# Altium project ECU.PrjPcb (part 1 of 2)
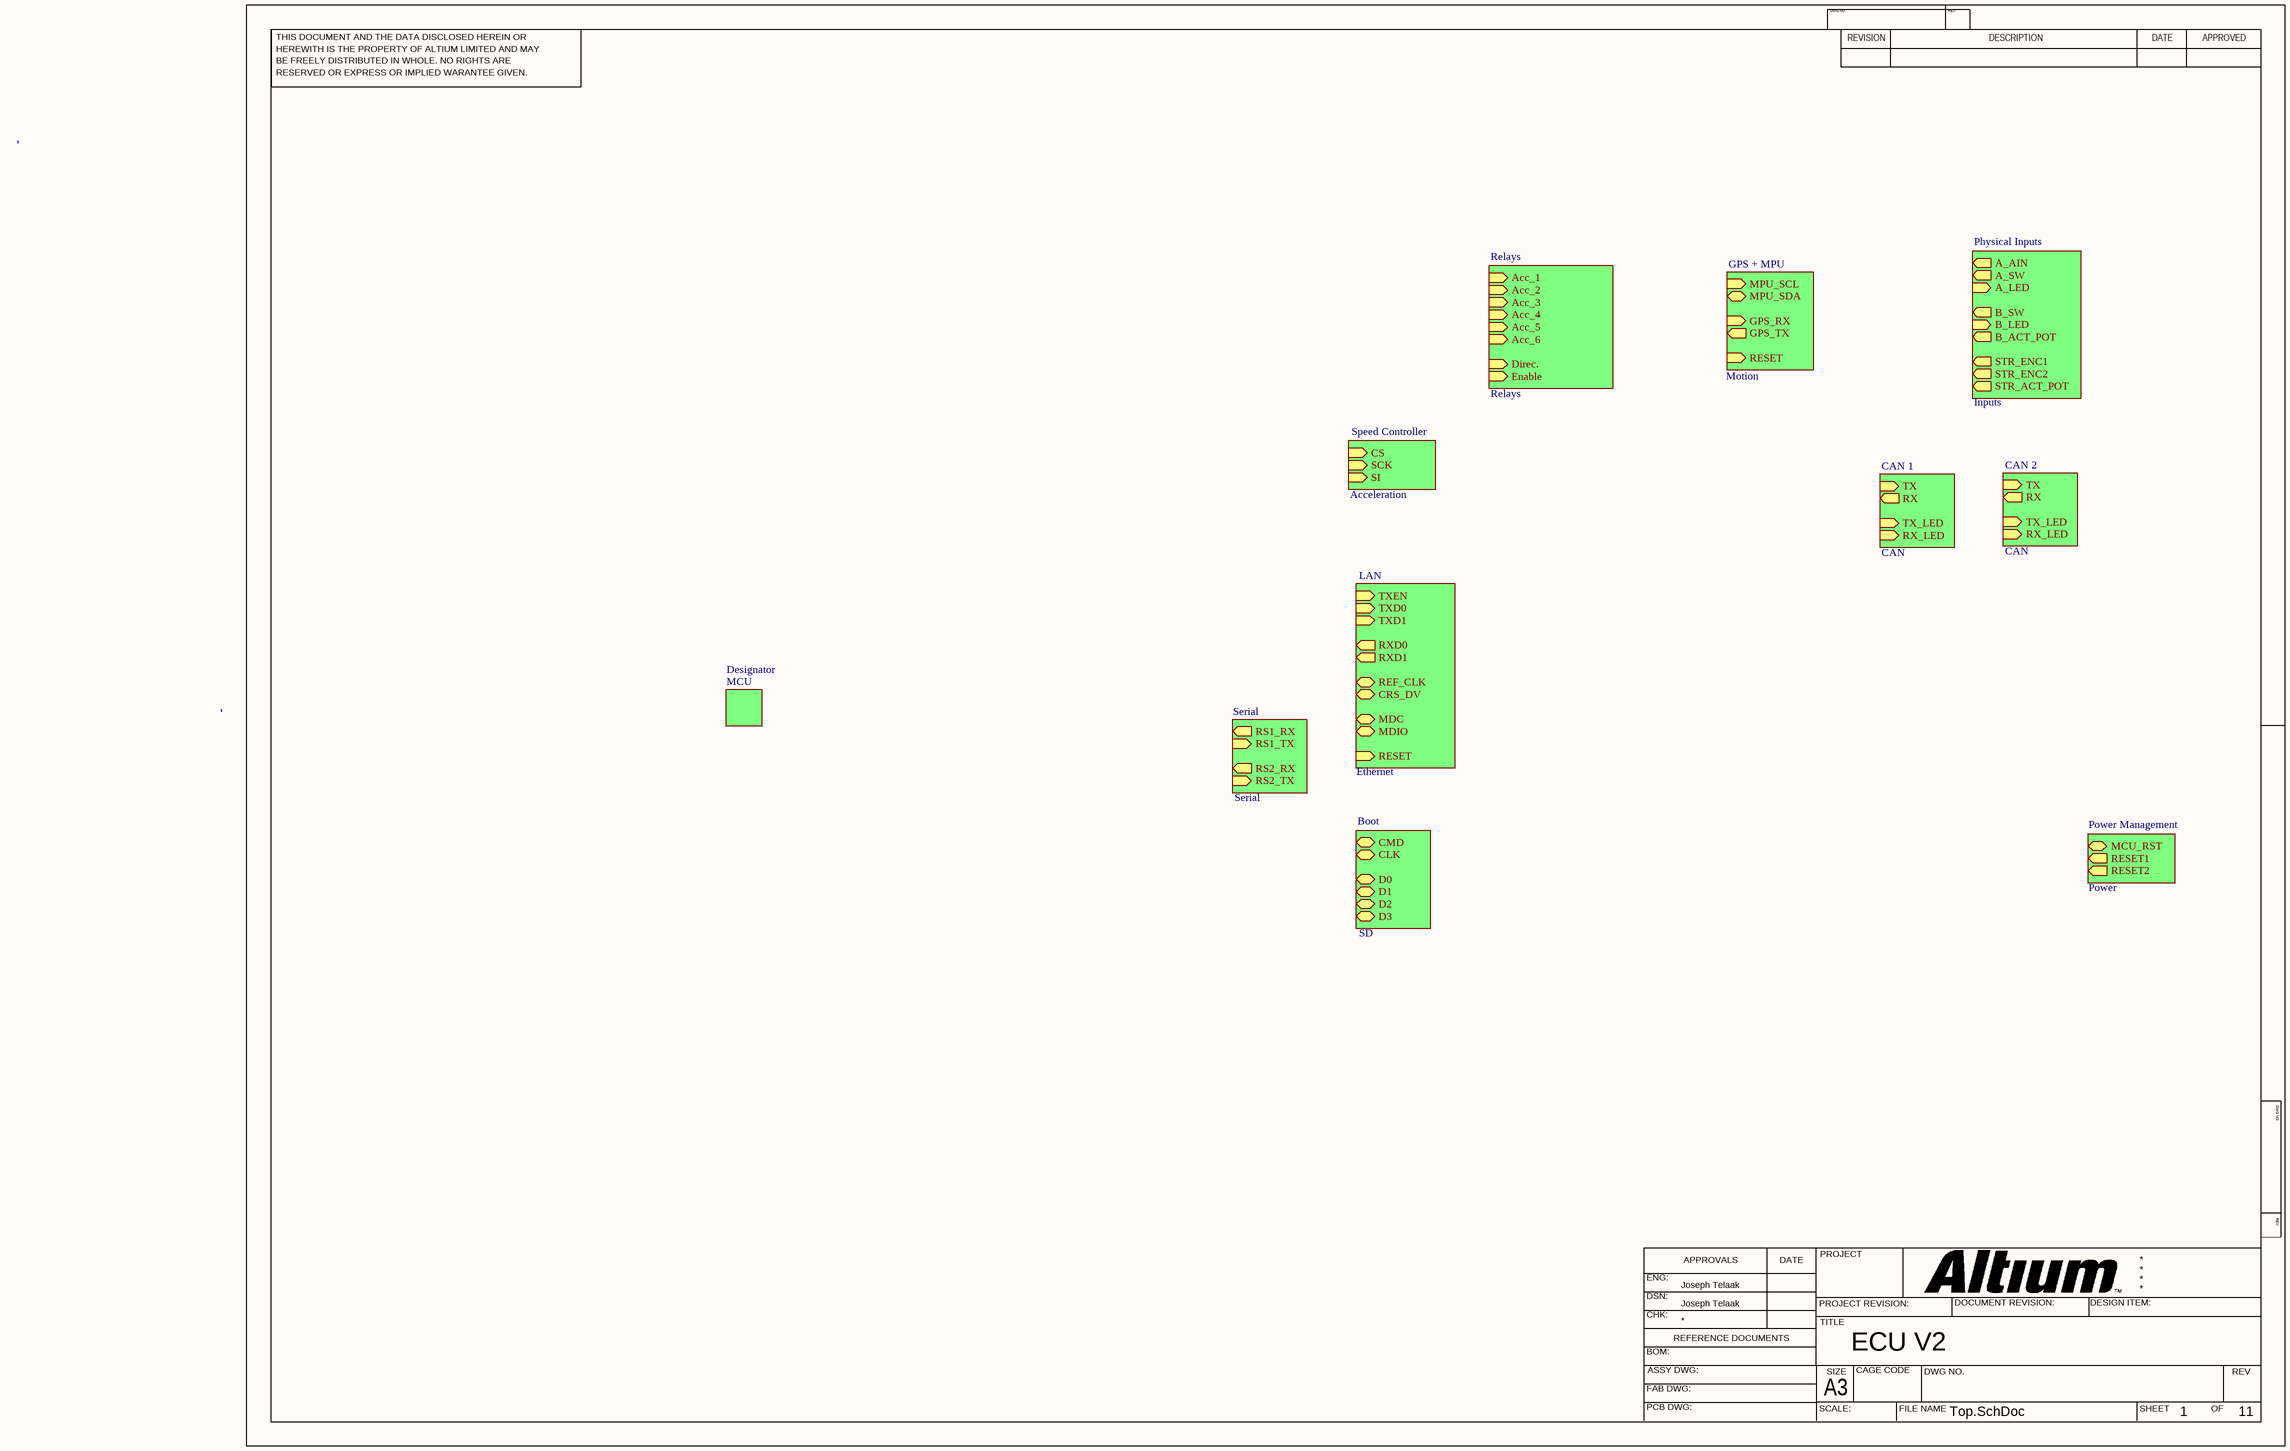
[diagram p0: Top.SchDoc]
11 sheets, 260 parts. Net scope: hierarchical (ports join the sheet entries above them; power ports are global).
Sheets:
  Top.SchDoc
    Power Management = Power.SchDoc
    Designator = MCU.SchDoc
    Relays = Relays.SchDoc
    Speed Controller = Acceleration.SchDoc
    Physical Inputs = Inputs.SchDoc
    LAN = Ethernet.SchDoc
    Boot = SD.SchDoc
    CAN 1 = CAN.SchDoc
    GPS + MPU = Motion.SchDoc
    Serial = Serial.SchDoc
    CAN 2 = CAN.SchDoc

## Sheet Top.SchDoc: ECU V2
size 420 x 297 mm; Date: 10/25/22; Author: Joseph Telaak; CompanyName: autogolfc.art; DrawnBy: Joseph Telaak; Engineer: Joseph Telaak; Organization: autogolfc.art; Revision: 2.1; SheetNumber: 1; SheetTotal: 11; Time: OCT 20

### Sub-sheets
Boot = SD: CMD (bidir), CLK (bidir), D0 (bidir), D1 (bidir), D2 (bidir), D3 (bidir)
CAN 1 = CAN: TX (in), RX (out), TX_LED (in), RX_LED (in)
CAN 2 = CAN: TX (in), RX (out), TX_LED (in), RX_LED (in)
Designator = MCU: no entries
GPS + MPU = Motion: MPU_SCL (in), MPU_SDA (bidir), GPS_RX (in), GPS_TX (out), RESET (in)
LAN = Ethernet: TXEN (in), TXD0 (in), TXD1 (in), RXD0 (out), RXD1 (out), REF_CLK (bidir), CRS_DV (bidir), MDC (bidir), MDIO (bidir), RESET (in)
Physical Inputs = Inputs: A_AIN (out), A_SW (out), A_LED (in), B_SW (out), B_LED (in), STR_ENC1 (out), STR_ENC2 (out), B_ACT_POT (out), STR_ACT_POT (out)
Power Management = Power: MCU_RST (bidir), RESET1 (out), RESET2 (out)
Relays = Relays: Acc_1 (in), Acc_2 (in), Acc_3 (in), Acc_4 (in), Acc_5 (in), Acc_6 (in), Direc. (in), Enable (in)
Serial = Serial: RS1_TX (in), RS1_RX (out), RS2_RX (out), RS2_TX (in)
Speed Controller = Acceleration: CS (in), SCK (in), SI (in)

### Notes on the sheet
- THIS DOCUMENT AND THE DATA DISCLOSED HEREIN OR
- HEREWITH IS THE PROPERTY OF ALTIUM LIMITED AND MAY
- DWG NO:
- REVISION
- REV:
- DESCRIPTION
- DATE
- APPROVED
- BE FREELY DISTRIBUTED IN WHOLE. NO RIGHTS ARE
- RESERVED OR EXPRESS OR IMPLIED WARANTEE GIVEN.
- ENG:
- APPROVALS
- PROJECT
- DSN:
- CHK:
- REFERENCE DOCUMENTS
- PROJECT REVISION:
- TITLE
- DOCUMENT REVISION:
- DESIGN ITEM:
- BOM:
- FAB DWG:
- PCB DWG:
- ASSY DWG:
- SCALE:
- A3
- SIZE
- CAGE CODE
- FILE NAME
- DWG NO.
- SHEET
- OF
- REV

## Sheet Power.SchDoc
size 420 x 297 mm; SheetNumber: 3; SheetTotal: 11
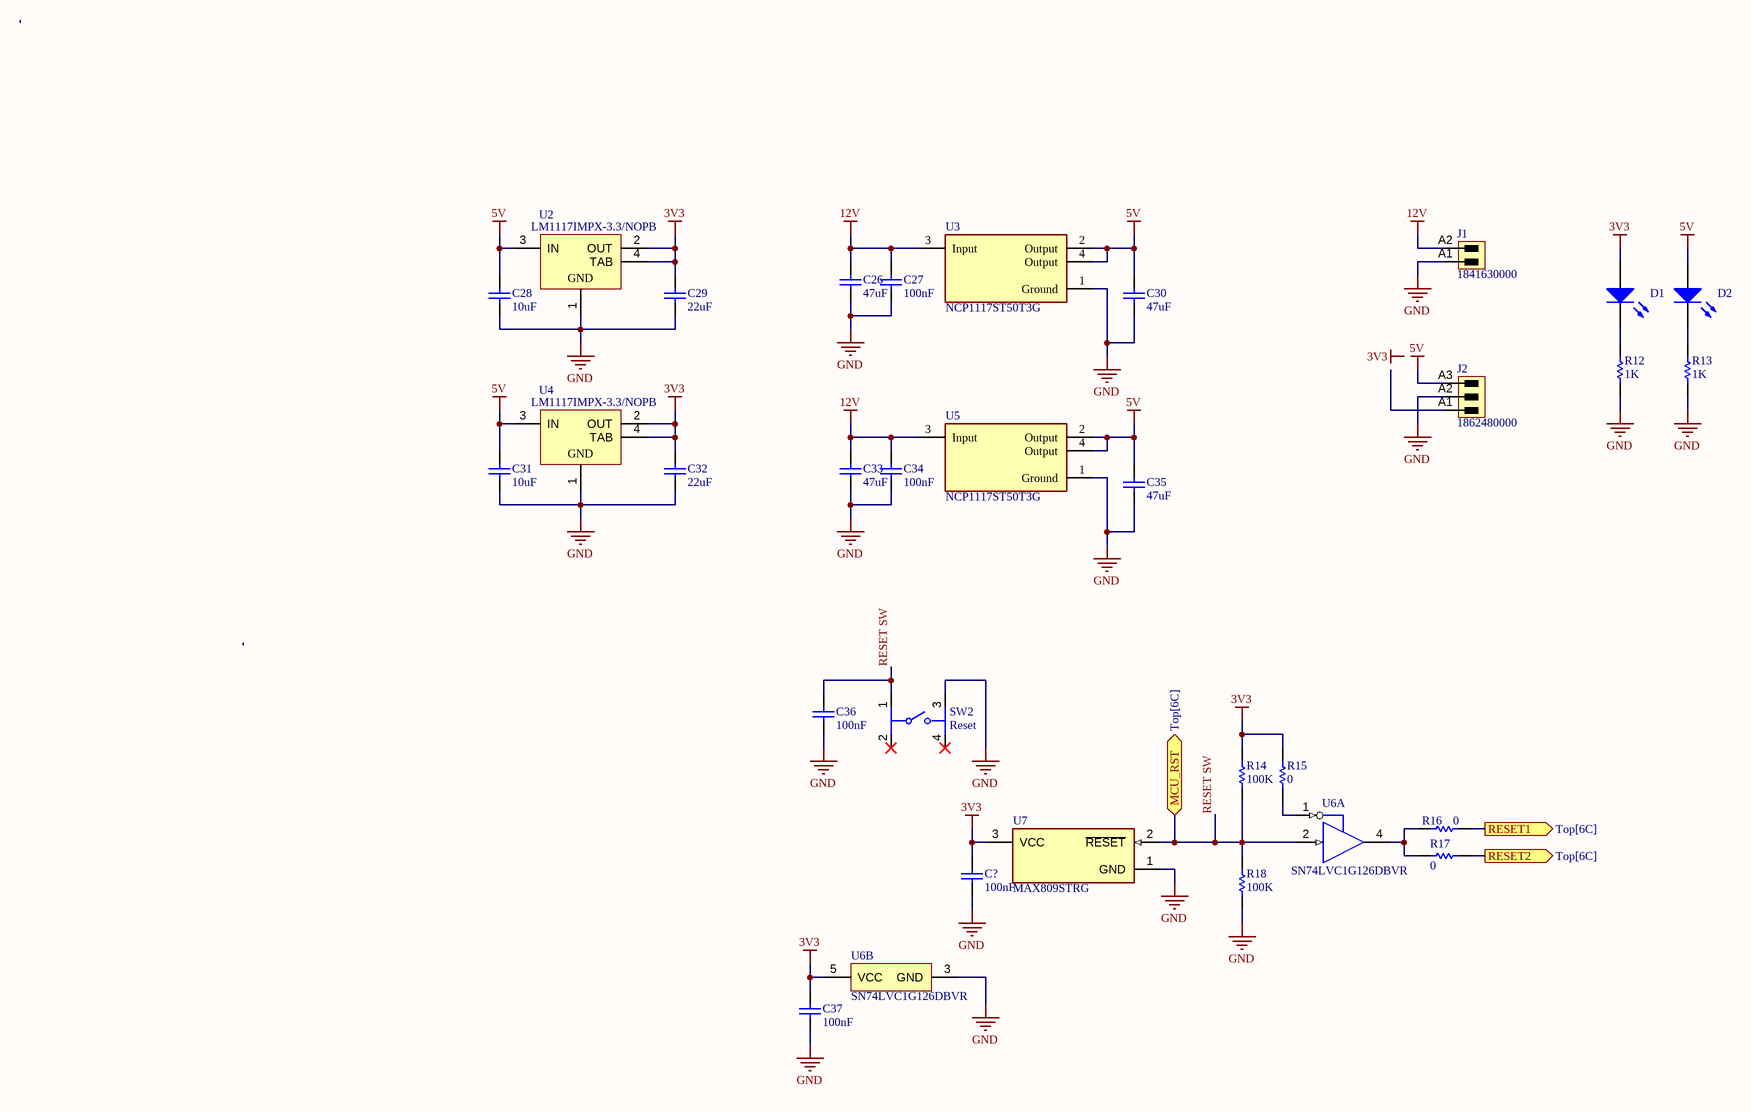
[diagram p1: Power.SchDoc]

### Parts
C26  value 47uF  (hidden comment: Capacitor)
C27  value 100nF  (hidden comment: Capacitor)
C28  value 10uF  (hidden comment: Capacitor)
C29  value 22uF  (hidden comment: Capacitor)
C30  value 47uF  (hidden comment: Capacitor)
C31  value 10uF  (hidden comment: Capacitor)
C32  value 22uF  (hidden comment: Capacitor)
C33  value 47uF  (hidden comment: Capacitor)
C34  value 100nF  (hidden comment: Capacitor)
C35  value 47uF  (hidden comment: Capacitor)
C36  value 100nF  (hidden comment: Capacitor)
C37  value 100nF  (hidden comment: Capacitor)
C?  value 100nF  (hidden comment: Capacitor)
D1  Light-Emitting Diode  (value not drawn)
D2  Light-Emitting Diode  (value not drawn)
J1  1841630000  [SL_SMT_3_5_90G_02]
J2  1862480000  [SC_SMT_3_81_90G_03]
R12  value 1K  (hidden comment: Resistor)
R13  value 1K  (hidden comment: Resistor)
R14  value 100K  (hidden comment: Resistor)
R15  value 0  (hidden comment: Resistor)
R16  value 0  (hidden comment: Resistor)
R17  value 0  (hidden comment: Resistor)
R18  value 100K  (hidden comment: Resistor)
SW2  Reset  [FP-PTS526SK15SMTR2LFS-MFG]
U2  LM1117IMPX-3.3/NOPB  [MP04A_M]
U3  NCP1117ST50T3G  [FP-318H-MFG]
U4  LM1117IMPX-3.3/NOPB  [MP04A_M]
U5  NCP1117ST50T3G  [FP-318H-MFG]
U6  SN74LVC1G126DBVR  [DBV0005A_L]  (parts A,B of 2)
U7  MAX809STRG  [FP-318-08-MFG]

### Ports
MCU_RST (bidir, see Top[6C]), RESET1 (out, see Top[6C]), RESET2 (out, see Top[6C])

### Nets
3V3: C29.2 C32.2 C37.1 C?.1 D1.1(A) R14.1 R15.1 U2.2(OUT) U2.4(TAB) U4.2(OUT) U4.4(TAB) U6.5(VCC) U7.3(VCC)  [project net RDCT]
5V: C28.2 C30.2 C31.2 C35.2 D2.1(A) J2.A3 U2.3(IN) U3.2(Output) U3.4(Output) U4.3(IN) U5.2(Output) U5.4(Output)
12V: C26.2 C27.2 C33.2 C34.2 J1.A2 U3.3(Input) U5.3(Input)
GND: C26.1 C27.1 C28.1 C29.1 C30.1 C31.1 C32.1 C33.1 C34.1 C35.1 C36.2 C37.2 C?.2 J1.A1 J2.A2 R12.2 R13.2 R18.2 SW2.3 U2.1(GND) U3.1(Ground) U4.1(GND) U5.1(Ground) U6.3(GND) U7.1(GND)
RESET SW: C36.1 R14.2 R18.1 SW2.1 U6.2(A) U7.2(~{RESET}) ; port MCU_RST
NetD1_2: D1.2(K) R12.1
NetD2_2: D2.2(K) R13.1
NetR15_2: R15.2 U6.1(OE)
NetR16_1: R16.1 ; port RESET1
NetR16_2: R16.2 R17.1 U6.4(Y)
NetR17_2: R17.2 ; port RESET2

Not connected (* = marked no-connect by the designer): J2 A1; SW2 2* 4*

### Notes on the sheet
- Labels drawn without touching a wire or pin: 3V3
- THIS DOCUMENT AND THE DATA DISCLOSED HEREIN OR
- HEREWITH IS THE PROPERTY OF ALTIUM LIMITED AND MAY
- DWG NO:
- REVISION
- REV:
- DESCRIPTION
- DATE
- APPROVED
- BE FREELY DISTRIBUTED IN WHOLE. NO RIGHTS ARE
- RESERVED OR EXPRESS OR IMPLIED WARANTEE GIVEN.
- ENG:
- APPROVALS
- PROJECT
- DSN:
- CHK:
- REFERENCE DOCUMENTS
- PROJECT REVISION:
- TITLE
- DOCUMENT REVISION:
- DESIGN ITEM:
- BOM:
- FAB DWG:
- PCB DWG:
- ASSY DWG:
- SCALE:
- A3
- SIZE
- CAGE CODE
- FILE NAME
- DWG NO.
- SHEET
- OF
- REV

### Library data of the parts
C26-C37 C? = Capacitor: SimulationGenericComponent: True
  C36 C37 C?: Supplier 1: Arrow Electronics
D1 D2 = LED: AF: 1; BV: 0; BV_MAX: 1e99; EG: 1.11; FC: 0.5; IBV: 0.001; IS: 1e-14; MJSW: 0.33; NTUN: 30; TNOM: 27; XTI: 3; SimulationGenericComponent: True; CJO: 0; CJP: 0; CTA: 0; CTP: 0; FCS: 0.5; FV_MAX: 1e99; IKF: 0; IKR: 0; ISR: 1e-14; JSW: 0; JTUN: 0; JTUNSW: 0; KEG: 1; KF: 0; LEVEL: 1; N: 1; NBV: 1; NR: 1; NS: 1; PHP: 1; RS: 0; TCV: 0; TLEV: 0; TLEVC: 0; TM1: 0; TM2: 0; TPB: 0; TPHP: 0; TRS: 0; TRS2: 0; TT: 0; TTT1: 0; TTT2: 0; VJ: 1; XTITUN: 3
J1 = CMP-1559-01184-1: OMNIMATE Signal - series BL/SL 3.50; Manufacturer: Weidmueller; Rated_voltage_use_group_B_UL_1059: 300 V; Mounting_onto_the_PCB: Reflow solder connection; Rated_current_min_no_of_poles_TU_20_deg_C: 15 A; Pitch_mm: 3.5 mm; Insulating_material: LCP GF; Pitch_inch: 0.138 inch; Rated_voltage_for_surge_voltage_class_pollution_degree_II_2: 320 V; Short_text_for_material: SL-SMT 3.50/02/90G 3.2SN BK BX; No_of_poles: 2; Contact_surface: tinned; Side_termination_characteristic: closed side; Rated_current_use_group_B_UL_1059: 10 A; UL_94_flammability_rating: V-0; Outgoing_elbow: 90°; Solder_pin_length_mm: 3.2 mm; Revision: V1; Qty: 100 PCS; ComponentLink2URL: http://catalog.weidmueller.com/catalog/Start.do?localeId=en&ObjectID=1841630000; Packaging: Box; Colour: Black; PackageReference: SL_SMT_3_5_90G_02; PartNumber: 1841630000; ComponentLink1Description: Manufacturer URL; ComponentLink1URL: http://www.weidmueller.com/; ComponentLink2Description: URL Link1
J2 = CMP-1559-00516-1: OMNIMATE Signal - series BC/SC 3.81; Manufacturer: Weidmueller; Rated_current_use_group_B_UL_1059: 10 A; Rated_voltage_for_surge_voltage_class_pollution_degree_II_2: 320 V; Contact_surface: tinned; Outgoing_elbow: 90°; Rated_voltage_use_group_B_UL_1059: 300 V; Solder_pin_length_mm: 3.2 mm; UL_94_flammability_rating: V-0; Rated_current_min_no_of_poles_TU_20_deg_C: 19 A; Insulating_material: LCP GF; Mounting_onto_the_PCB: Reflow solder connection; No_of_poles: 3; Short_text_for_material: SC-SMT 3.81/03/90G 3.2SN BK BX; Contact_material: Cu-Leg; Pitch_inch: 0.15 inch; Side_termination_characteristic: closed side; Pitch_mm: 3.81 mm; Revision: V1; ComponentLink1URL: http://www.weidmueller.com/; ComponentLink2Description: URL Link1; ComponentLink1Description: Manufacturer URL; Colour: Black; ComponentLink2URL: http://catalog.weidmueller.com/catalog/Start.do?localeId=en&ObjectID=1862480000; PartNumber: 1862480000; Packaging: Box; PackageReference: SC_SMT_3_81_90G_03; Qty: 50 PCS
R12-R14 R18 = Resistor: TC1: 0; SimulationGenericComponent: True; TC2: 0
  R14 R18: Supplier 1: Digi-Key; Supplier Part Number 1: P0.0GCT-ND
R15-R17 = Resistor: SimulationGenericComponent: True; TC1: 0; TC2: 0; Supplier 1: Digi-Key; Supplier Part Number 1: P0.0GCT-ND
SW2 = CMP-10040-000013-1: TACT 5.2 X 5.2, 1.5 MM H, 260GF,; Manufacturer: C&K; Manufacturer Part Number: PTS526SK15SMTR2LFS; Operating Force: 250gf; Throw Configuration: SPST-NO; Contact Current Rating: 50mA; Standoff Height: 0mm; Contact Resistance: 100mΩ; Voltage Rating Dc: 12V; Electromechanical Life: 200000Cycles; Device Class L3: Tactile Switches; Device Class L2: Switches; Temperature: -20°C to +70°C; Temperature Range Low: -20°C; Package: PTS526SK15SMTR2LFS; Temperature Range High: +70°C; ComponentLink2Description: Datasheet; Device Class L1: Electromechanical; Height: 1.65mm; Digikey Description: TACT 5.2 X 5.2, 1.5 MM H, 260GF,; Category: Switch; RoHS: TRUE; Automotive: No; Lead Free: Yes; Octopart: https://octopart.com/pts526+sk15+smtr2+lfs-c%26k+components-100617999; ComponentLink2URL: https://www.ckswitches.com/media/2780/pts526.pdf
U2 U4 = CMP-0062-01632-3: 800mA Low-Dropout Linear Regulator, 4-pin SOT-223, Pb-Free; Manufacturer: National Semiconductor; CompType: LDO IC; PackageTopMarking: XYTT*N05B; High-Reliability: Y; PowerWise: N; ComponentLink3Description: LM1117 Web Page; Code_JEDEC: TO-261-AA; RoHS: Y; PackageReference: MP04A; ComponentLink3URL: http://www.national.com/pf/LM/LM1117.html; RevisionNote: SCH symbol layout adjusted; ComponentLink2URL: http://www.national.com/ds/LM/LM1117.pdf; ComponentLink2Description: LM1117 Datasheet; ComponentLink1Description: Manufacturer URL; ComponentLink4Description: MP04A Package Page; ComponentLink4URL: http://www.national.com/packaging/folders/mp04a.html; PackageVersion: revB, Apr-2003; DatasheetVersion: Apr-2006; PackageDescription: Molded SOT-223, 6.50 x 3.56 x 1.6mm Body, 4 Lead, 2.3mm Pitch; Code_IPC: SOT223-4; ComponentLink1URL: http://www.national.com/; PinCount: 4; PartNumber: LM1117IMPX-3.3/NOPB
U3 U5 = CMP-0592-00001-4: IC REG LINEAR 5V 1A SOT223; Output Voltage Accuracy: 1%; Number of Outputs: 1; Dropout Voltage: 1.2V; Polarity: Positive; Power Rating: 781mW; Input Bias Current: 6mA; Quiescent Current: 10mA; Output Type: Fixed; Max Input Voltage: 20V; Min Input Voltage: 3.5V; Max Operating Temperature: 125°C; Number of Pins: 4; Case/Package: SOT-223; Min Operating Temperature: 0°C; Accuracy: 1%; Contact Plating: Tin; Min Current Limit: 1A; Output Current: 1A; Max Output Current: 1A; Length: 6.7mm; Packaging: Tape and Reel; Package Quantity: 1; Height: 1.69mm; REACH SVHC: No SVHC; Width: 3.7mm; Halogen Free: Halogen Free; RoHS Compliant: Yes; Nominal Output Voltage: 5V; Lead Free: Lead Free; Radiation Hardening: No; Tolerance: 1%; Number of Regulators: 1; Output Voltage: 5V
U6 = CMP-0859-00036-3: Single Bus Buffer Gate With 3-State Outputs, DBV0005A, LARGE T&R; Manufacturer: Texas Instruments; Bits(#): 1; Sub-Family: Non-Inverting Buffer/Driver; F @ Nom Voltage(Max)(Mhz): 150; VCC(Min)(V): 1.65; Input Type: CMOS/TTL; Voltage(Nom)(V): 1.8,2.5,3.3,5; Output Type: CMOS; ICC @ Nom Voltage(Max)(mA): 0.01; Technology Family: LVC; Logic: True; VCC(Max)(V): 5.5; Schmitt Trigger: No; 3-State Output: Yes; tpd @ Nom Voltage(Max)(ns): 8,5.5,4.5,4; Rating: Catalog; Output Drive (IOL/IOH)(Max)(mA): 32/-32; DatasheetVersion: SCES224R; Operating Temperature Range(C): -40 to 125,-40 to 85; PackageReference: DBV0005A; Generic Part Number: SN74LVC1G126
U7 = CMP-07130-000007-1: IC MPU SUPERVISORY 2.93V SOT23; Manufacturer: ON SEMICONDUCTOR; Number Of Outputs: 1; Nominal Supply Current: 0.5-0.8uA; Min Supply Voltage: 1V; Max Junction Temp: +125°C; Max Supply Voltage: 5.5V; Reset Timeout: 10us; Output Current: 20mA; Output Voltage: 0.3V; Reset Type: Active Low; Standoff Height: 0.01mm; Octopart: https://octopart.com/max809strg-on+semiconductor-509853; Category: IC; Temperature: -40°C to +125°C; Temperature Range Low: -40°C; ComponentLink2URL: https://www.onsemi.cn/PowerSolutions/document/MAX809S-D.PDF; Device Class L1: Integrated Circuits (ICs); Automotive: No; Package: 318-08; Device Class L2: Power Management ICs; RoHS: TRUE; Height: 1.11mm; Digikey Description: IC MPU SUPERVISORY 2.93V SOT23; Mouser Description: Supervisory Circuits 2.93V uP Reset; ComponentLink2Description: Datasheet; Manufacturer Part Number: MAX809STRG; Temperature Range High: +125°C; Number Of Rails Monitored: 1; Threshold Voltage: 2.93V; Footprint Url: https://www.onsemi.com/pub/Collateral/318-08.PDF; Device Class L3: Voltage Supervisors; Lead Free: Yes

## Sheet MCU.SchDoc
size 420 x 297 mm; SheetNumber: 2; SheetTotal: 11
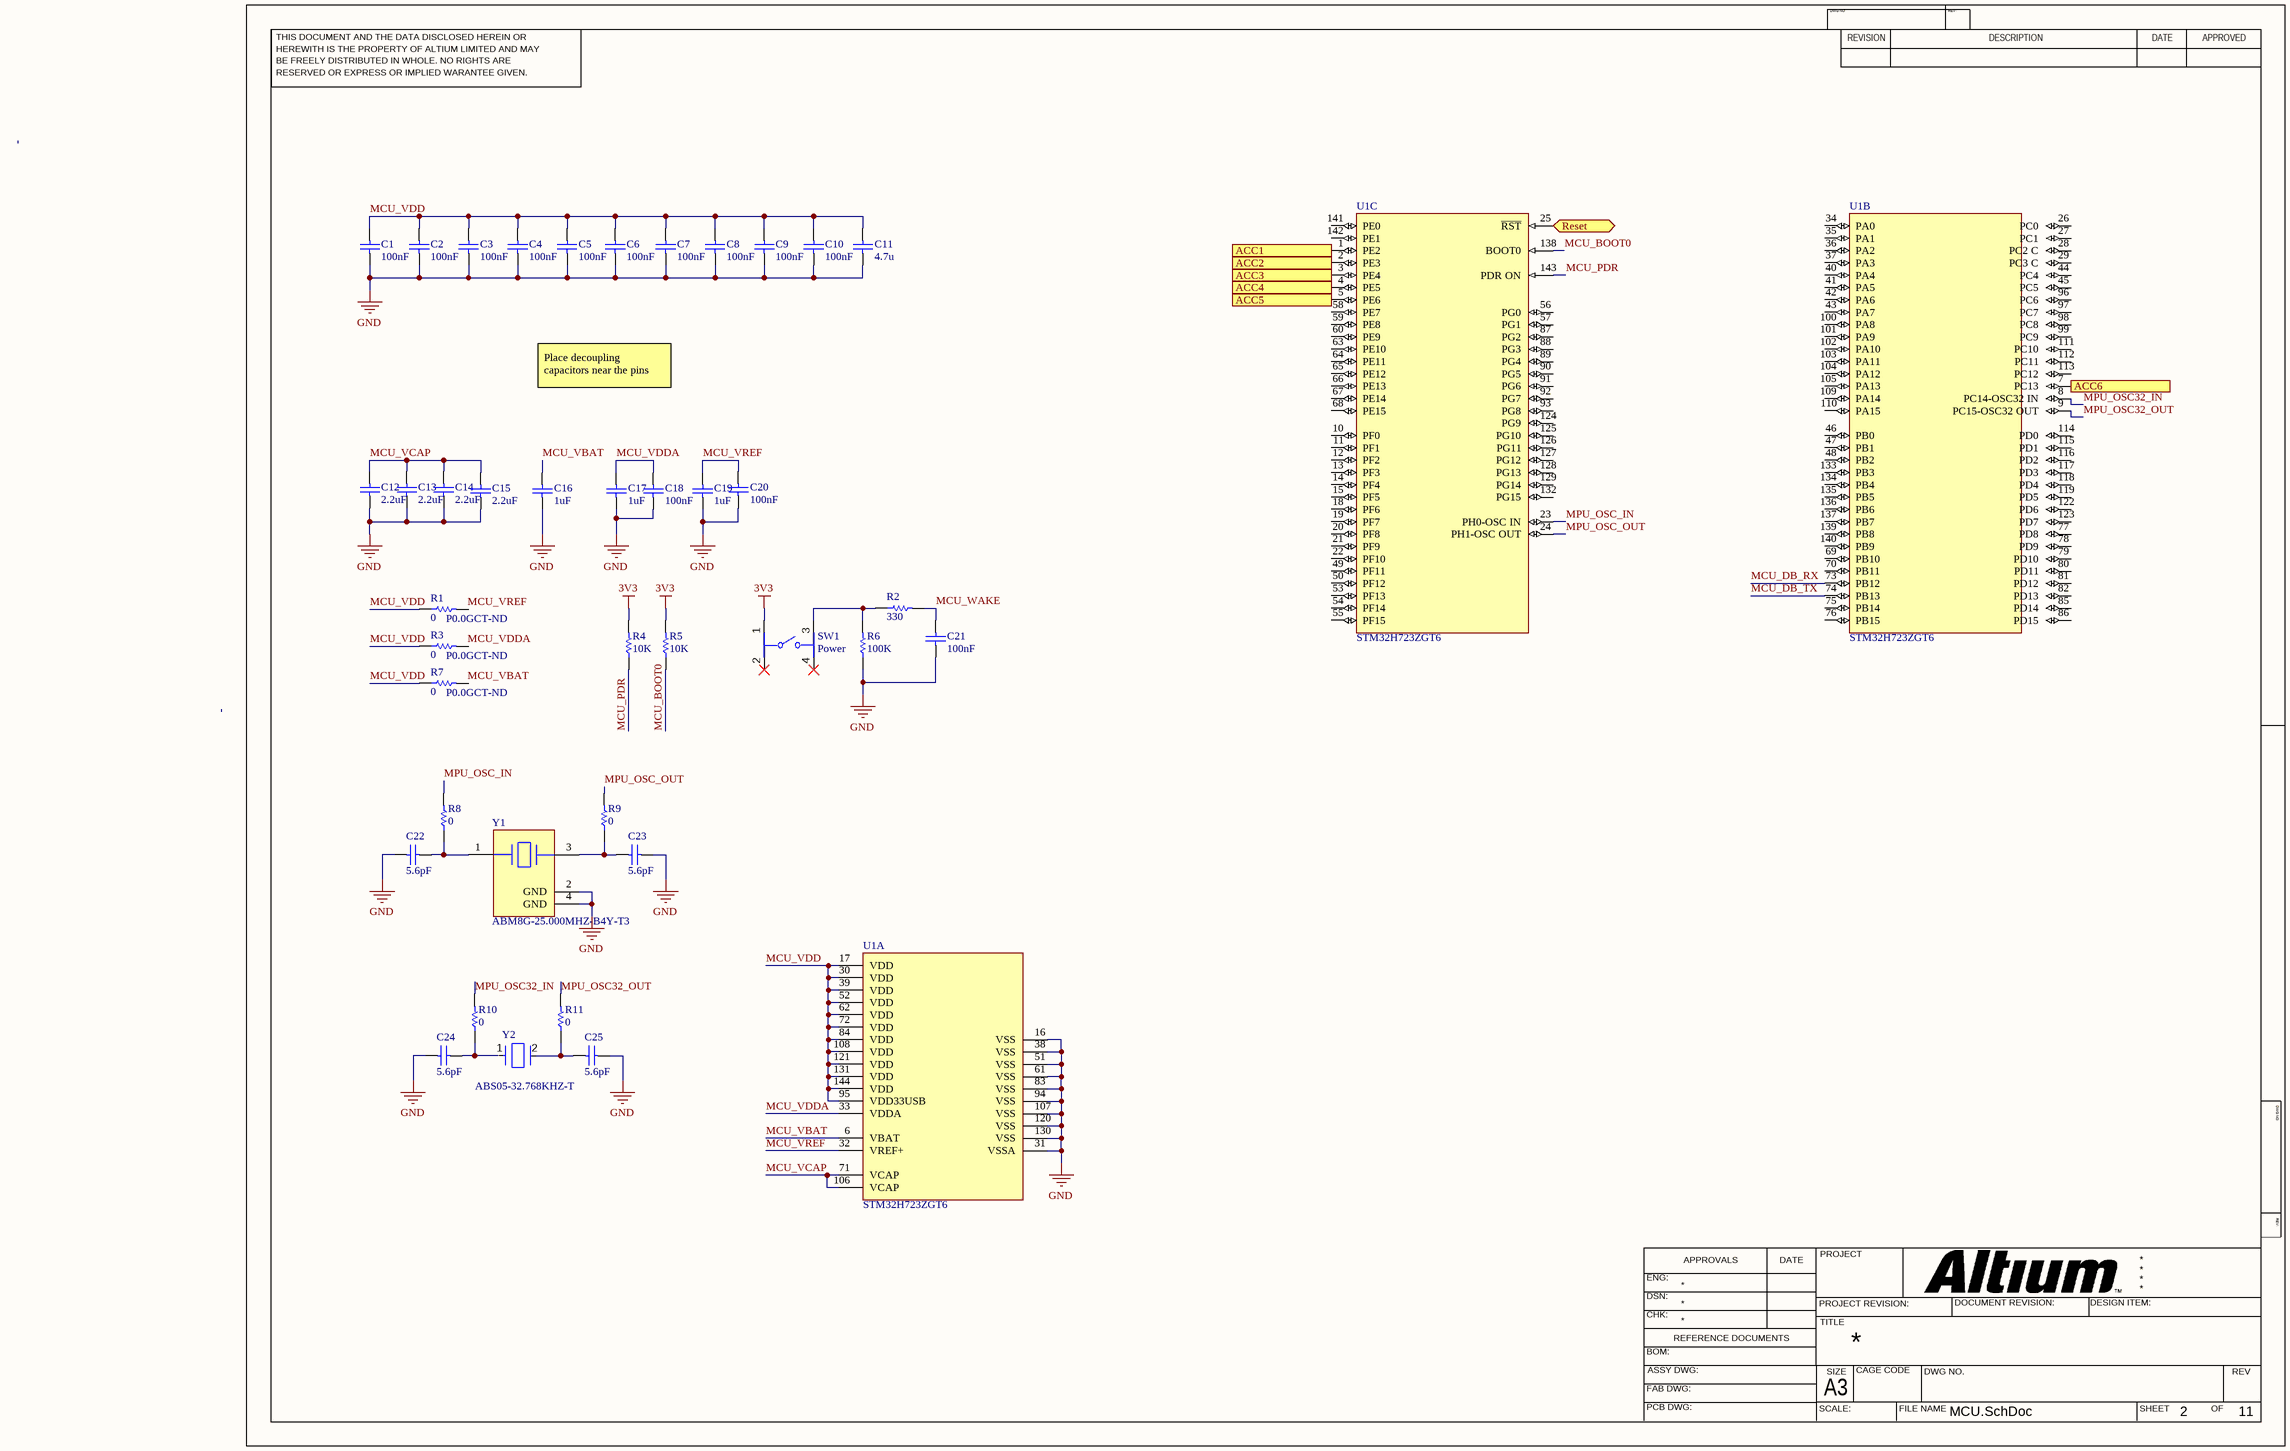
[diagram p2: MCU.SchDoc]

### Parts
C1  value 100nF  (hidden comment: Capacitor)
C2  value 100nF  (hidden comment: Capacitor)
C3  value 100nF  (hidden comment: Capacitor)
C4  value 100nF  (hidden comment: Capacitor)
C5  value 100nF  (hidden comment: Capacitor)
C6  value 100nF  (hidden comment: Capacitor)
C7  value 100nF  (hidden comment: Capacitor)
C8  value 100nF  (hidden comment: Capacitor)
C9  value 100nF  (hidden comment: Capacitor)
C10  value 100nF  (hidden comment: Capacitor)
C11  value 4.7u  (hidden comment: Capacitor)
C12  value 2.2uF  (hidden comment: Capacitor)
C13  value 2.2uF  (hidden comment: Capacitor)
C14  value 2.2uF  (hidden comment: Capacitor)
C15  value 2.2uF  (hidden comment: Capacitor)
C16  value 1uF  (hidden comment: Capacitor)
C17  value 1uF  (hidden comment: Capacitor)
C18  value 100nF  (hidden comment: Capacitor)
C19  value 1uF  (hidden comment: Capacitor)
C20  value 100nF  (hidden comment: Capacitor)
C21  value 100nF  (hidden comment: Capacitor)
C22  value 5.6pF  (hidden comment: Capacitor)
C23  value 5.6pF  (hidden comment: Capacitor)
C24  value 5.6pF  (hidden comment: Capacitor)
C25  value 5.6pF  (hidden comment: Capacitor)
R1  value 0  Supplier Part Number 1: P0.0GCT-ND  (hidden comment: Resistor)
R2  value 330  (hidden comment: Resistor)
R3  value 0  Supplier Part Number 1: P0.0GCT-ND  (hidden comment: Resistor)
R4  value 10K  (hidden comment: Resistor)
R5  value 10K  (hidden comment: Resistor)
R6  value 100K  (hidden comment: Resistor)
R7  value 0  Supplier Part Number 1: P0.0GCT-ND  (hidden comment: Resistor)
R8  value 0  (hidden comment: Resistor)
R9  value 0  (hidden comment: Resistor)
R10  value 0  (hidden comment: Resistor)
R11  value 0  (hidden comment: Resistor)
SW1  Power  [FP-PTS526SK15SMTR2LFS-MFG]
U1  STM32H723ZGT6  [FP-LQFP144-1A-IPC_A]  (parts A,B,C of 3)
Y1  ABM8G-25.000MHZ-B4Y-T3  [FP-ABM8G-MFG]
Y2  ABS05-32.768KHZ-T  [FP-ABS05-MFG]

### Ports
ACC1 (out), ACC2 (out), ACC3 (out), ACC4 (out), ACC5 (out), ACC6 (out), Reset (bidir)

### Nets
3V3: R4.2 R5.2 SW1.1  [project net RDCT]
GND: C1.1 C2.1 C3.1 C4.1 C5.1 C6.1 C7.1 C8.1 C9.1 C10.1 C11.1 C12.1 C13.1 C14.1 C15.1 C16.1 C17.1 C18.1 C19.1 C20.1 C21.1 C22.2 C23.1 C24.2 C25.1 R6.1 U1.16(VSS) U1.31(VSSA) U1.38(VSS) U1.51(VSS) U1.61(VSS) U1.83(VSS) U1.94(VSS) U1.107(VSS) U1.120(VSS) U1.130(VSS) Y1.2(GND) Y1.4(GND)
MCU_BOOT0: R5.1 U1.138(BOOT0)
MCU_DB_RX: U1.73(PB12)
MCU_DB_TX: U1.74(PB13)
MCU_PDR: R4.1 U1.143(PDR_ON)
MCU_VBAT: C16.2 U1.6(VBAT)
MCU_VCAP: C12.2 C13.2 C14.2 C15.2 U1.71(VCAP) U1.106(VCAP)
MCU_VDD: C1.2 C2.2 C3.2 C4.2 C5.2 C6.2 C7.2 C8.2 C9.2 C10.2 C11.2 R1.1 R3.1 R7.1 U1.17(VDD) U1.30(VDD) U1.39(VDD) U1.52(VDD) U1.62(VDD) U1.72(VDD) U1.84(VDD) U1.95(VDD33USB) U1.108(VDD) U1.121(VDD) U1.131(VDD) U1.144(VDD)
MCU_VDDA: C17.2 C18.2 U1.33(VDDA)
MCU_VREF: C19.2 C20.2 U1.32(VREF+)
MCU_WAKE: C21.2 R2.2
MPU_OSC32_IN: R10.2 U1.8(PC14-OSC32_IN)
MPU_OSC32_OUT: R11.2 U1.9(PC15-OSC32_OUT)
MPU_OSC_IN: R8.2 U1.23(PH0-OSC_IN)
MPU_OSC_OUT: R9.2 U1.24(PH1-OSC_OUT)
NetC22_1: C22.1 R8.1 Y1.1
NetC23_2: C23.2 R9.1 Y1.3
NetC24_1: C24.1 R10.1
NetC25_2: C25.2 R11.1 Y2.2
NetR2_1: R2.1 R6.2 SW1.3
NetU1_1: U1.1(PE2) ; port ACC1
NetU1_2: U1.2(PE3) ; port ACC2
NetU1_3: U1.3(PE4) ; port ACC3
NetU1_4: U1.4(PE5) ; port ACC4
NetU1_5: U1.5(PE6) ; port ACC5
NetU1_7: U1.7(PC13) ; port ACC6
NetU1_25: U1.25(~{RST}) ; port Reset

Not connected (* = marked no-connect by the designer): R1 2; R3 2; R7 2; SW1 2* 4*; U1 10(PF0) 11(PF1) 12(PF2) 13(PF3) 14(PF4) 15(PF5) 18(PF6) 19(PF7) 20(PF8) 21(PF9) 22(PF10) 26(PC0) 27(PC1) 28(PC2_C) 29(PC3_C) 34(PA0) 35(PA1) 36(PA2) 37(PA3) 40(PA4) 41(PA5) 42(PA6) 43(PA7) 44(PC4) 45(PC5) 46(PB0) 47(PB1) 48(PB2) 49(PF11) 50(PF12) 53(PF13) 54(PF14) 55(PF15) 56(PG0) 57(PG1) 58(PE7) 59(PE8) 60(PE9) 63(PE10) 64(PE11) 65(PE12) 66(PE13) 67(PE14) 68(PE15) 69(PB10) 70(PB11) 75(PB14) 76(PB15) 77(PD8) 78(PD9) 79(PD10) 80(PD11) 81(PD12) 82(PD13) 85(PD14) 86(PD15) 87(PG2) 88(PG3) 89(PG4) 90(PG5) 91(PG6) 92(PG7) 93(PG8) 96(PC6) 97(PC7) 98(PC8) 99(PC9) 100(PA8) 101(PA9) 102(PA10) 103(PA11) 104(PA12) 105(PA13) 109(PA14) 110(PA15) 111(PC10) 112(PC11) 113(PC12) 114(PD0) 115(PD1) 116(PD2) 117(PD3) 118(PD4) 119(PD5) 122(PD6) 123(PD7) 124(PG9) 125(PG10) 126(PG11) 127(PG12) 128(PG13) 129(PG14) 132(PG15) 133(PB3) 134(PB4) 135(PB5) 136(PB6) 137(PB7) 139(PB8) 140(PB9) 141(PE0) 142(PE1); Y2 1

### Notes on the sheet
- Place decoupling capacitors near the pins
- Labels drawn without touching a wire or pin: MCU_VBAT, MCU_VDDA, MCU_VREF
- THIS DOCUMENT AND THE DATA DISCLOSED HEREIN OR
- HEREWITH IS THE PROPERTY OF ALTIUM LIMITED AND MAY
- DWG NO:
- REVISION
- REV:
- DESCRIPTION
- DATE
- APPROVED
- BE FREELY DISTRIBUTED IN WHOLE. NO RIGHTS ARE
- RESERVED OR EXPRESS OR IMPLIED WARANTEE GIVEN.
- ENG:
- APPROVALS
- PROJECT
- DSN:
- CHK:
- REFERENCE DOCUMENTS
- PROJECT REVISION:
- TITLE
- DOCUMENT REVISION:
- DESIGN ITEM:
- BOM:
- FAB DWG:
- PCB DWG:
- ASSY DWG:
- SCALE:
- A3
- SIZE
- CAGE CODE
- FILE NAME
- DWG NO.
- SHEET
- OF
- REV

### Library data of the parts
C1-C25 = Capacitor: SimulationGenericComponent: True
  C1-C10 C18 C20 C21: Supplier 1: Arrow Electronics
R1 R3 R7-R11 = Resistor: SimulationGenericComponent: True; TC1: 0; TC2: 0; Supplier 1: Digi-Key
  R8-R11: Supplier Part Number 1: P0.0GCT-ND
R2 R4-R6 = Resistor: TC1: 0; SimulationGenericComponent: True; TC2: 0
SW1 = CMP-10040-000013-1: as SW2 on sheet Power; Device Class L3: Tactile Switches; Device Class L2: Switches; Temperature: -20°C to +70°C; Temperature Range Low: -20°C; Package: PTS526SK15SMTR2LFS; Temperature Range High: +70°C; ComponentLink2Description: Datasheet; Device Class L1: Electromechanical; Height: 1.65mm; Digikey Description: TACT 5.2 X 5.2, 1.5 MM H, 260GF,; Category: Switch; RoHS: TRUE; Automotive: No; Lead Free: Yes; Octopart: https://octopart.com/pts526+sk15+smtr2+lfs-c%26k+components-100617999; ComponentLink2URL: https://www.ckswitches.com/media/2780/pts526.pdf
U1 = CMP-12105-000148-1: IC MCU 32BIT 1MB FLASH 144LQFP
Y1 = CMP-27762-015306-1: Crystal 25MHz ±30ppm (Tol) ±30ppm (Stability) 10pF FUND 60Ω 4-Pin SMD T/R; ESR (Equivalent Series Resistance): 60R; Max Operating Temperature: 70°C; Packaging: Tape and Reel; Length: 0.126inch; Height: 0.039inch; Frequency Stability: 30ppm; Package Quantity: 3000; Width: 2.5mm; Number of Pins: 4; Case/Package: SMD/SMT; Mount: Surface Mount; Series: ABM8G; Load Capacitance: 10pF; Min Operating Temperature: -20°C; Termination: SMD/SMT; Frequency: 25MHz; Tolerance: 30ppm; Frequency Tolerance: 30ppm
Y2 = CMP-27762-008890-2: Crystal 32.768kHz ±20ppm (Tol) 12.5pF FUND 90kΩ 2-Pin SMD T/R; Series Resistance: 90kR; Length: 1.6mm; Package Quantity: 3000; Packaging: Tape and Reel; Max Operating Temperature: 85°C; Lead Free: Lead Free; Tolerance: 20ppm; Frequency: 32.768kHz; Termination: SMD/SMT; REACH SVHC: No SVHC; Width: 1mm; Min Operating Temperature: -40°C; RoHS Compliant: Yes; Case/Package: CSMD; ESR (Equivalent Series Resistance): 90kR; Number of Pins: 2; Height: 0.5mm; Series: ABS05; Load Capacitance: 12.5pF; Frequency Tolerance: 20ppm; Depth: 1mm; Operating Frequency: 32.768 kHz; Mount: Surface Mount; Radiation Hardening: No

## Sheet Relays.SchDoc
size 420 x 297 mm; SheetNumber: 9; SheetTotal: 11
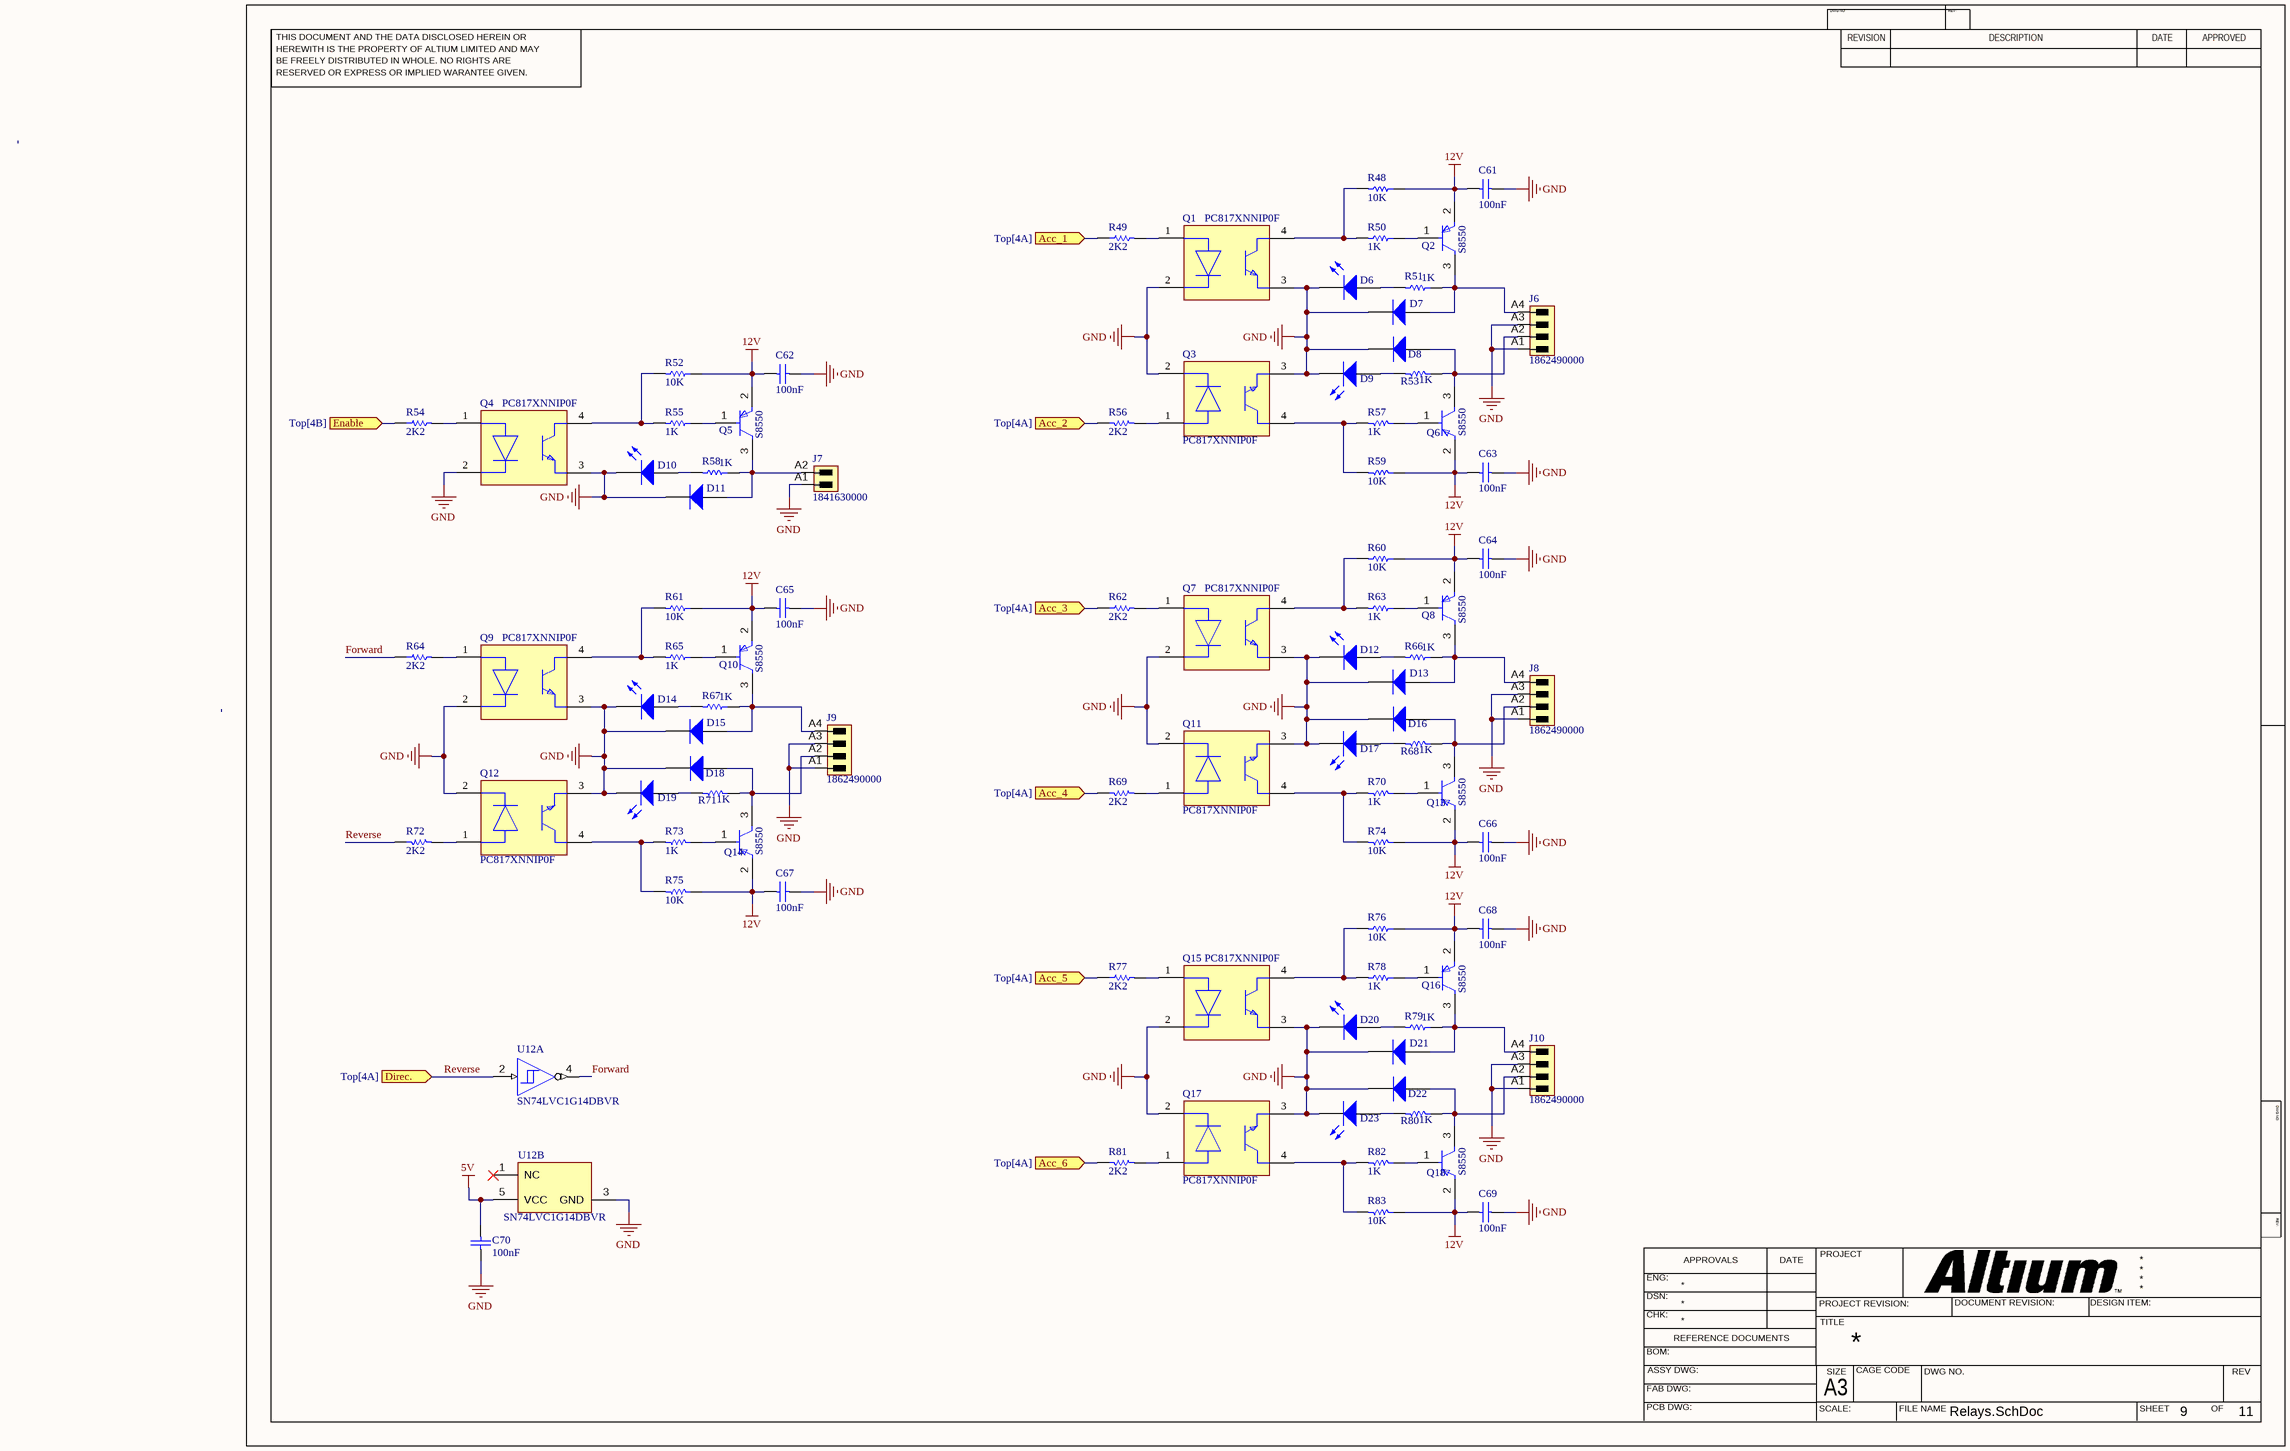
[diagram p3: Relays.SchDoc]

### Parts
C61  value 100nF  (hidden comment: Capacitor)
C62  value 100nF  (hidden comment: Capacitor)
C63  value 100nF  (hidden comment: Capacitor)
C64  value 100nF  (hidden comment: Capacitor)
C65  value 100nF  (hidden comment: Capacitor)
C66  value 100nF  (hidden comment: Capacitor)
C67  value 100nF  (hidden comment: Capacitor)
C68  value 100nF  (hidden comment: Capacitor)
C69  value 100nF  (hidden comment: Capacitor)
C70  value 100nF  (hidden comment: Capacitor)
D6  Light-Emitting Diode  (value not drawn)
D7  Diode  (value not drawn)
D8  Diode  (value not drawn)
D9  Light-Emitting Diode  (value not drawn)
D10  Light-Emitting Diode  (value not drawn)
D11  Diode  (value not drawn)
D12  Light-Emitting Diode  (value not drawn)
D13  Diode  (value not drawn)
D14  Light-Emitting Diode  (value not drawn)
D15  Diode  (value not drawn)
D16  Diode  (value not drawn)
D17  Light-Emitting Diode  (value not drawn)
D18  Diode  (value not drawn)
D19  Light-Emitting Diode  (value not drawn)
D20  Light-Emitting Diode  (value not drawn)
D21  Diode  (value not drawn)
D22  Diode  (value not drawn)
D23  Light-Emitting Diode  (value not drawn)
J6  1862490000  [SC_SMT_3_81_90G_04]
J7  1841630000  [SL_SMT_3_5_90G_02]
J8  1862490000  [SC_SMT_3_81_90G_04]
J9  1862490000  [SC_SMT_3_81_90G_04]
J10  1862490000  [SC_SMT_3_81_90G_04]
Q1  PC817XNNIP0F  [FP-PC817XNNIP0F-MFG]
Q2  S8550  [FP-SOT-23-IPC_B]
Q3  PC817XNNIP0F  [FP-PC817XNNIP0F-MFG]
Q4  PC817XNNIP0F  [FP-PC817XNNIP0F-MFG]
Q5  S8550  [FP-SOT-23-IPC_B]
Q6  S8550  [FP-SOT-23-IPC_B]
Q7  PC817XNNIP0F  [FP-PC817XNNIP0F-MFG]
Q8  S8550  [FP-SOT-23-IPC_B]
Q9  PC817XNNIP0F  [FP-PC817XNNIP0F-MFG]
Q10  S8550  [FP-SOT-23-IPC_B]
Q11  PC817XNNIP0F  [FP-PC817XNNIP0F-MFG]
Q12  PC817XNNIP0F  [FP-PC817XNNIP0F-MFG]
Q13  S8550  [FP-SOT-23-IPC_B]
Q14  S8550  [FP-SOT-23-IPC_B]
Q15  PC817XNNIP0F  [FP-PC817XNNIP0F-MFG]
Q16  S8550  [FP-SOT-23-IPC_B]
Q17  PC817XNNIP0F  [FP-PC817XNNIP0F-MFG]
Q18  S8550  [FP-SOT-23-IPC_B]
R48  value 10K  (hidden comment: Resistor)
R49  value 2K2  (hidden comment: Resistor)
R50  value 1K  (hidden comment: Resistor)
R51  value 1K  (hidden comment: Resistor)
R52  value 10K  (hidden comment: Resistor)
R53  value 1K  (hidden comment: Resistor)
R54  value 2K2  (hidden comment: Resistor)
R55  value 1K  (hidden comment: Resistor)
R56  value 2K2  (hidden comment: Resistor)
R57  value 1K  (hidden comment: Resistor)
R58  value 1K  (hidden comment: Resistor)
R59  value 10K  (hidden comment: Resistor)
R60  value 10K  (hidden comment: Resistor)
R61  value 10K  (hidden comment: Resistor)
R62  value 2K2  (hidden comment: Resistor)
R63  value 1K  (hidden comment: Resistor)
R64  value 2K2  (hidden comment: Resistor)
R65  value 1K  (hidden comment: Resistor)
R66  value 1K  (hidden comment: Resistor)
R67  value 1K  (hidden comment: Resistor)
R68  value 1K  (hidden comment: Resistor)
R69  value 2K2  (hidden comment: Resistor)
R70  value 1K  (hidden comment: Resistor)
R71  value 1K  (hidden comment: Resistor)
R72  value 2K2  (hidden comment: Resistor)
R73  value 1K  (hidden comment: Resistor)
R74  value 10K  (hidden comment: Resistor)
R75  value 10K  (hidden comment: Resistor)
R76  value 10K  (hidden comment: Resistor)
R77  value 2K2  (hidden comment: Resistor)
R78  value 1K  (hidden comment: Resistor)
R79  value 1K  (hidden comment: Resistor)
R80  value 1K  (hidden comment: Resistor)
R81  value 2K2  (hidden comment: Resistor)
R82  value 1K  (hidden comment: Resistor)
R83  value 10K  (hidden comment: Resistor)
U12  SN74LVC1G14DBVR  [DBV0005A_L]  (parts A,B of 2)

### Ports
Acc_1 (in, see Top[4A]), Acc_2 (in, see Top[4A]), Acc_3 (in, see Top[4A]), Acc_4 (in, see Top[4A]), Acc_5 (in, see Top[4A]), Acc_6 (in, see Top[4A]), Direc. (in, see Top[4A]), Enable (in, see Top[4B])

### Nets
5V: C70.1 U12.5(VCC)
12V: C61.1 C62.1 C63.1 C64.1 C65.1 C66.1 C67.1 C68.1 C69.1 Q2.2(E) Q5.2(E) Q6.2(E) Q8.2(E) Q10.2(E) Q13.2(E) Q14.2(E) Q16.2(E) Q18.2(E) R48.1 R52.1 R59.1 R60.1 R61.1 R74.1 R75.1 R76.1 R83.1
GND: C61.2 C62.2 C63.2 C64.2 C65.2 C66.2 C67.2 C68.2 C69.2 C70.2 D6.2(K) D7.2(K) D8.2(K) D9.2(K) D10.2(K) D11.2(K) D12.2(K) D13.2(K) D14.2(K) D15.2(K) D16.2(K) D17.2(K) D18.2(K) D19.2(K) D20.2(K) D21.2(K) D22.2(K) D23.2(K) J6.A1 J6.A3 J7.A1 J8.A1 J8.A3 J9.A1 J9.A3 J10.A1 J10.A3 Q1.2(C) Q1.3(E) Q3.2(C) Q3.3(E) Q4.2(C) Q4.3(E) Q7.2(C) Q7.3(E) Q9.2(C) Q9.3(E) Q11.2(C) Q11.3(E) Q12.2(C) Q12.3(E) Q15.2(C) Q15.3(E) Q17.2(C) Q17.3(E) U12.3(GND)
Forward: R64.1 U12.4(Y)
Reverse: R72.1 U12.2(A) ; port Direc.
NetD6_1: D6.1(A) R51.2
NetD7_1: D7.1(A) J6.A4 Q2.3(C) R51.1
NetD8_1: D8.1(A) J6.A2 Q6.3(C) R53.1
NetD9_1: D9.1(A) R53.2
NetD10_1: D10.1(A) R58.2
NetD11_1: D11.1(A) J7.A2 Q5.3(C) R58.1
NetD12_1: D12.1(A) R66.2
NetD13_1: D13.1(A) J8.A4 Q8.3(C) R66.1
NetD14_1: D14.1(A) R67.2
NetD15_1: D15.1(A) J9.A4 Q10.3(C) R67.1
NetD16_1: D16.1(A) J8.A2 Q13.3(C) R68.1
NetD17_1: D17.1(A) R68.2
NetD18_1: D18.1(A) J9.A2 Q14.3(C) R71.1
NetD19_1: D19.1(A) R71.2
NetD20_1: D20.1(A) R79.2
NetD21_1: D21.1(A) J10.A4 Q16.3(C) R79.1
NetD22_1: D22.1(A) J10.A2 Q18.3(C) R80.1
NetD23_1: D23.1(A) R80.2
NetQ1_1: Q1.1(A) R49.2
NetQ1_4: Q1.4(C) R48.2 R50.2
NetQ2_1: Q2.1(B) R50.1
NetQ3_1: Q3.1(A) R56.2
NetQ3_4: Q3.4(C) R57.2 R59.2
NetQ4_1: Q4.1(A) R54.2
NetQ4_4: Q4.4(C) R52.2 R55.2
NetQ5_1: Q5.1(B) R55.1
NetQ6_1: Q6.1(B) R57.1
NetQ7_1: Q7.1(A) R62.2
NetQ7_4: Q7.4(C) R60.2 R63.2
NetQ8_1: Q8.1(B) R63.1
NetQ9_1: Q9.1(A) R64.2
NetQ9_4: Q9.4(C) R61.2 R65.2
NetQ10_1: Q10.1(B) R65.1
NetQ11_1: Q11.1(A) R69.2
NetQ11_4: Q11.4(C) R70.2 R74.2
NetQ12_1: Q12.1(A) R72.2
NetQ12_4: Q12.4(C) R73.2 R75.2
NetQ13_1: Q13.1(B) R70.1
NetQ14_1: Q14.1(B) R73.1
NetQ15_1: Q15.1(A) R77.2
NetQ15_4: Q15.4(C) R76.2 R78.2
NetQ16_1: Q16.1(B) R78.1
NetQ17_1: Q17.1(A) R81.2
NetQ17_4: Q17.4(C) R82.2 R83.2
NetQ18_1: Q18.1(B) R82.1
NetR49_1: R49.1 ; port Acc_1
NetR54_1: R54.1 ; port Enable
NetR56_1: R56.1 ; port Acc_2
NetR62_1: R62.1 ; port Acc_3
NetR69_1: R69.1 ; port Acc_4
NetR77_1: R77.1 ; port Acc_5
NetR81_1: R81.1 ; port Acc_6

Not connected (* = marked no-connect by the designer): U12 1(NC)*

### Notes on the sheet
- THIS DOCUMENT AND THE DATA DISCLOSED HEREIN OR
- HEREWITH IS THE PROPERTY OF ALTIUM LIMITED AND MAY
- DWG NO:
- REVISION
- REV:
- DESCRIPTION
- DATE
- APPROVED
- BE FREELY DISTRIBUTED IN WHOLE. NO RIGHTS ARE
- RESERVED OR EXPRESS OR IMPLIED WARANTEE GIVEN.
- ENG:
- APPROVALS
- PROJECT
- DSN:
- CHK:
- REFERENCE DOCUMENTS
- PROJECT REVISION:
- TITLE
- DOCUMENT REVISION:
- DESIGN ITEM:
- BOM:
- FAB DWG:
- PCB DWG:
- ASSY DWG:
- SCALE:
- A3
- SIZE
- CAGE CODE
- FILE NAME
- DWG NO.
- SHEET
- OF
- REV

### Library data of the parts
C61-C70 = Capacitor: SimulationGenericComponent: True; Supplier 1: Arrow Electronics
D6 D9 D10 D12 D14 D17 D19 D20 D23 = LED: as D1 on sheet Power; CJO: 0; CJP: 0; CTA: 0; CTP: 0; FCS: 0.5; FV_MAX: 1e99; IKF: 0; IKR: 0; ISR: 1e-14; JSW: 0; JTUN: 0; JTUNSW: 0; KEG: 1; KF: 0; LEVEL: 1; N: 1; NBV: 1; NR: 1; NS: 1; PHP: 1; RS: 0; TCV: 0; TLEV: 0; TLEVC: 0; TM1: 0; TM2: 0; TPB: 0; TPHP: 0; TRS: 0; TRS2: 0; TT: 0; TTT1: 0; TTT2: 0; VJ: 1; XTITUN: 3
D7 D8 D11 D13 D15 D16 D18 D21 D22 = Diode: AF: 1; BV: 0; BV_MAX: 1e99; EG: 1.11; FC: 0.5; IBV: 0.001; ISR: 1e-14; MJSW: 0.33; NTUN: 30; TNOM: 27; XTI: 3; SimulationGenericComponent: True; CJO: 0; CJP: 0; CTA: 0; CTP: 0; FCS: 0.5; FV_MAX: 1e99; IKF: 0; IKR: 0; JSW: 0; JTUN: 0; JTUNSW: 0; KEG: 1; KF: 0; LEVEL: 1; N: 1; NBV: 1; NR: 1; NS: 1; PHP: 1; RS: 0; TCV: 0; TLEV: 0; TLEVC: 0; TM1: 0; TM2: 0; TPB: 0; TPHP: 0; TRS: 0; TRS2: 0; TT: 0; TTT1: 0; TTT2: 0; VJ: 1; XTITUN: 3; IS: 1e-14
J6 J8-J10 = CMP-1559-00524-1: OMNIMATE Signal - series BC/SC 3.81; Manufacturer: Weidmueller; Side_termination_characteristic: closed side; Pitch_mm: 3.81 mm; UL_94_flammability_rating: V-0; Outgoing_elbow: 90°; Rated_voltage_use_group_B_UL_1059: 300 V; No_of_poles: 4; Rated_current_min_no_of_poles_TU_20_deg_C: 19 A; Rated_current_use_group_B_UL_1059: 10 A; Solder_pin_length_mm: 3.2 mm; Contact_surface: tinned; Contact_material: Cu-Leg; Rated_voltage_for_surge_voltage_class_pollution_degree_II_2: 320 V; Mounting_onto_the_PCB: Reflow solder connection; Short_text_for_material: SC-SMT 3.81/04/90G 3.2SN BK BX; Insulating_material: LCP GF; Pitch_inch: 0.15 inch; ComponentLink2Description: URL Link1; Qty: 50 PCS; Colour: Black; ComponentLink1URL: http://www.weidmueller.com/; Packaging: Box; PackageReference: SC_SMT_3_81_90G_04; ComponentLink1Description: Manufacturer URL; ComponentLink2URL: http://catalog.weidmueller.com/catalog/Start.do?localeId=en&ObjectID=1862490000; PartNumber: 1862490000; Revision: V1
J7 = CMP-1559-01184-1: as J1 on sheet Power; Revision: V1; Qty: 100 PCS; ComponentLink2URL: http://catalog.weidmueller.com/catalog/Start.do?localeId=en&ObjectID=1841630000; Packaging: Box; Colour: Black; PackageReference: SL_SMT_3_5_90G_02; PartNumber: 1841630000; ComponentLink1Description: Manufacturer URL; ComponentLink1URL: http://www.weidmueller.com/; ComponentLink2Description: URL Link1
Q1 Q3 Q4 Q7 Q9 Q11 Q12 Q15 Q17 = CMP-65434-000005-1: OPTOISOLATOR 5KV TRANS 4SMD; Reverse Breakdown Voltage: 6V; Output Current per Channel: 30mA; Power Dissipation: 200mW; Collector-emitter Voltage-Max: 200mV; Max Output Voltage: 80V; Input Current: 50mA; Forward Voltage: 1.4V; Fall Time: 18000ns; Number of Elements: 1; Input Type: DC; Packaging: Tape and Reel; RoHS Compliant: Yes; Contact Plating: Copper; Min Operating Temperature: -30°C; Collector Emitter Saturation Voltage: 200mV; Max Input Current: 50mA; Radiation Hardening: No; Max Collector Current: 50mA; Case/Package: SMD/SMT; Mount: Surface Mount; Output Voltage: 80V; Forward Current: 50mA; Max Power Dissipation: 200mW; Collector Emitter Voltage (VCEO): 80V; Number of Channels: 1; Rise Time: 18000ns; Isolation Voltage: 5kV; Number of Pins: 4; Lead Free: Lead Free; Package Quantity: 2000; Isolation Voltage-Max: 5kV; Max Operating Temperature: 100°C
Q2 Q5 Q6 Q8 Q10 Q13 Q14 Q16 Q18 = CMP-56214-000002-1: TRANS PNP 25V 1.5A SOT23; Emitter Base Voltage (VEBO): 1.6V; Collector Base Voltage (VCBO): 40V; Collector Emitter Saturation Voltage: 500mV; Max Power Dissipation: 625mW; Transition Frequency: 100MHz; Element Configuration: Single; hFE Min: 40; Polarity: PNP; Lead Free: Lead Free; Max Breakdown Voltage: 25V; Package Quantity: 1; Min Operating Temperature: -55°C; Case/Package: SOT-23; Max Collector Current: 1.5A; Mount: Surface Mount; Packaging: Tape and Reel; Collector Emitter Voltage (VCEO): 500mV; Max Operating Temperature: 150°C; Gain Bandwidth Product: 100MHz; Collector Emitter Breakdown Voltage: 25V
R48-R83 = Resistor: TC1: 0; SimulationGenericComponent: True; TC2: 0
U12 = CMP-0859-00030-4: Single Schmitt-Trigger Inverter, DBV0005A, LARGE T&R; Manufacturer: Texas Instruments; Input Type: CMOS/TTL; Output Drive (IOL/IOH)(Max)(mA): 32/-32; VCC(Min)(V): 1.65; 3-State Output: No; Schmitt Trigger: Yes; tpd @ Nom Voltage(Max)(ns): 11,6.5,5.5,5; VCC(Max)(V): 5.5; Output Type: CMOS; Bits(#): 1; Voltage(Nom)(V): 1.8,2.5,3.3,5; Sub-Family: Inverting Buffer/Driver; Logic: Inverting; Technology Family: LVC; F @ Nom Voltage(Max)(Mhz): 150; Rating: Catalog; ICC @ Nom Voltage(Max)(mA): 0.01; DatasheetVersion: SCES218W; PackageReference: DBV0005A; Generic Part Number: SN74LVC1G14; Operating Temperature Range(C): -40 to 125,-40 to 85

## Sheet Acceleration.SchDoc
size 420 x 297 mm; SheetNumber: 10; SheetTotal: 11
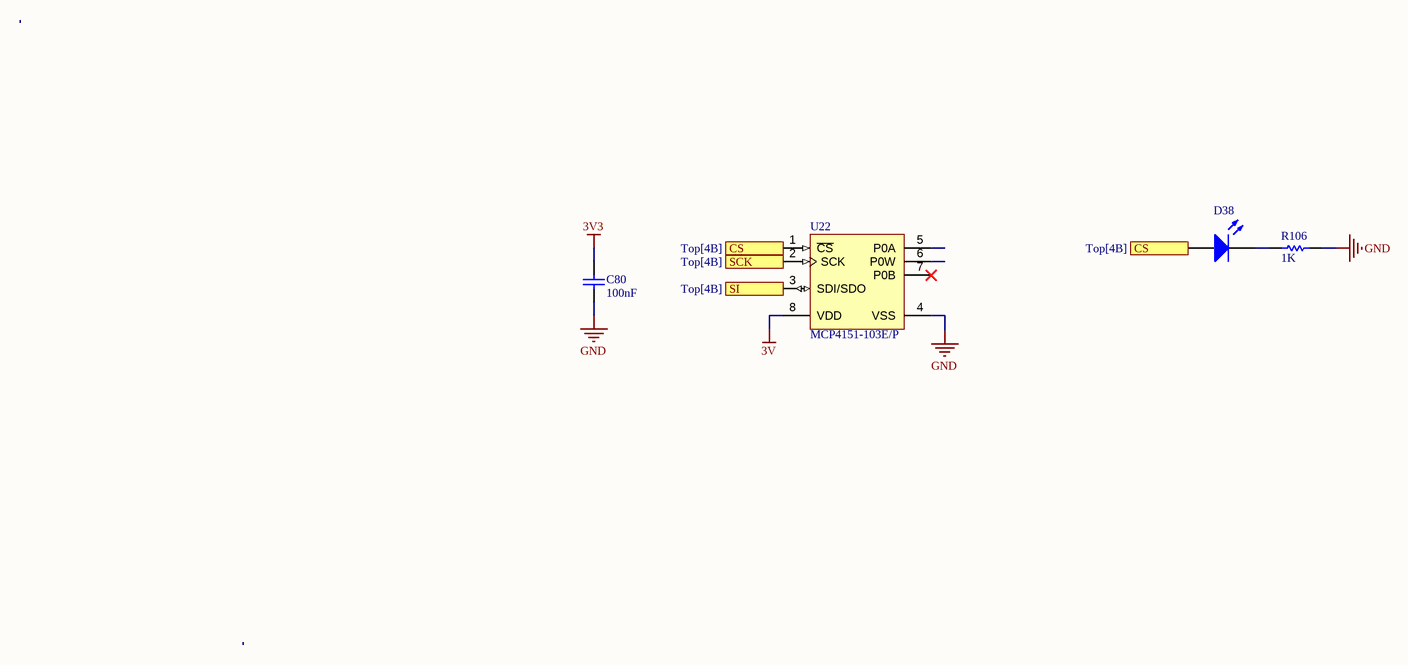
[diagram p4: Acceleration.SchDoc]

### Parts
C80  value 100nF  (hidden comment: Capacitor)
D38  Light-Emitting Diode  (value not drawn)
R106  value 1K  (hidden comment: Resistor)
U22  MCP4151-103E/P  [PDIP300-P8]

### Ports
CS (in, see Top[4B]), SCK (in, see Top[4B]), SI (in, see Top[4B])

### Nets
3V: U22.8(VDD)
3V3: C80.2  [project net RDCT]
GND: C80.1 R106.2 U22.4(VSS)
NetD38_1: D38.1(A) U22.1(~{CS}) ; port CS
NetD38_2: D38.2(K) R106.1
NetU22_2: U22.2(SCK) ; port SCK
NetU22_3: U22.3(SDI/SDO) ; port SI

Not connected (* = marked no-connect by the designer): U22 5(P0A) 6(P0W) 7(P0B)*

### Notes on the sheet
- THIS DOCUMENT AND THE DATA DISCLOSED HEREIN OR
- HEREWITH IS THE PROPERTY OF ALTIUM LIMITED AND MAY
- DWG NO:
- REVISION
- REV:
- DESCRIPTION
- DATE
- APPROVED
- BE FREELY DISTRIBUTED IN WHOLE. NO RIGHTS ARE
- RESERVED OR EXPRESS OR IMPLIED WARANTEE GIVEN.
- ENG:
- APPROVALS
- PROJECT
- DSN:
- CHK:
- REFERENCE DOCUMENTS
- PROJECT REVISION:
- TITLE
- DOCUMENT REVISION:
- DESIGN ITEM:
- BOM:
- FAB DWG:
- PCB DWG:
- ASSY DWG:
- SCALE:
- A3
- SIZE
- CAGE CODE
- FILE NAME
- DWG NO.
- SHEET
- OF
- REV

### Library data of the parts
C80 = Capacitor: SimulationGenericComponent: True; Supplier 1: Arrow Electronics
D38 = LED: as D1 on sheet Power; CJO: 0; CJP: 0; CTA: 0; CTP: 0; FCS: 0.5; FV_MAX: 1e99; IKF: 0; IKR: 0; ISR: 1e-14; JSW: 0; JTUN: 0; JTUNSW: 0; KEG: 1; KF: 0; LEVEL: 1; N: 1; NBV: 1; NR: 1; NS: 1; PHP: 1; RS: 0; TCV: 0; TLEV: 0; TLEVC: 0; TM1: 0; TM2: 0; TPB: 0; TPHP: 0; TRS: 0; TRS2: 0; TT: 0; TTT1: 0; TTT2: 0; VJ: 1; XTITUN: 3
R106 = Resistor: TC1: 0; SimulationGenericComponent: True; TC2: 0
U22 = CMP-0188-00257-2: 7/8-Bit Single/Dual SPI Digital POT with Volatile Memory, 8-Pin PDIP, Extended Temperature; RevisionNote: URLs added.; PackageReference: PDIP300-P8; ComponentLink1Description: Manufacturer URL; ComponentLink3URL: http://www.microchip.com/stellent/groups/techpub_sg/documents/packagingspec/en012702.pdf; PackageDescription: 8-Lead Plastic Dual In-Line (P) - 300 mil Body [PDIP]; ComponentLink2Description: Datasheet; Code_JEDEC: MS-001; ComponentLink2URL: http://ww1.microchip.com/downloads/en/DeviceDoc/22060b.pdf; DatasheetVersion: revB, Dec-2008; ComponentLink1URL: http://www.microchip.com/; ComponentLink3Description: Package Specification; PackageVersion: revBB, Aug-2009

## Sheet Inputs.SchDoc
size 420 x 297 mm; SheetNumber: 11; SheetTotal: 11
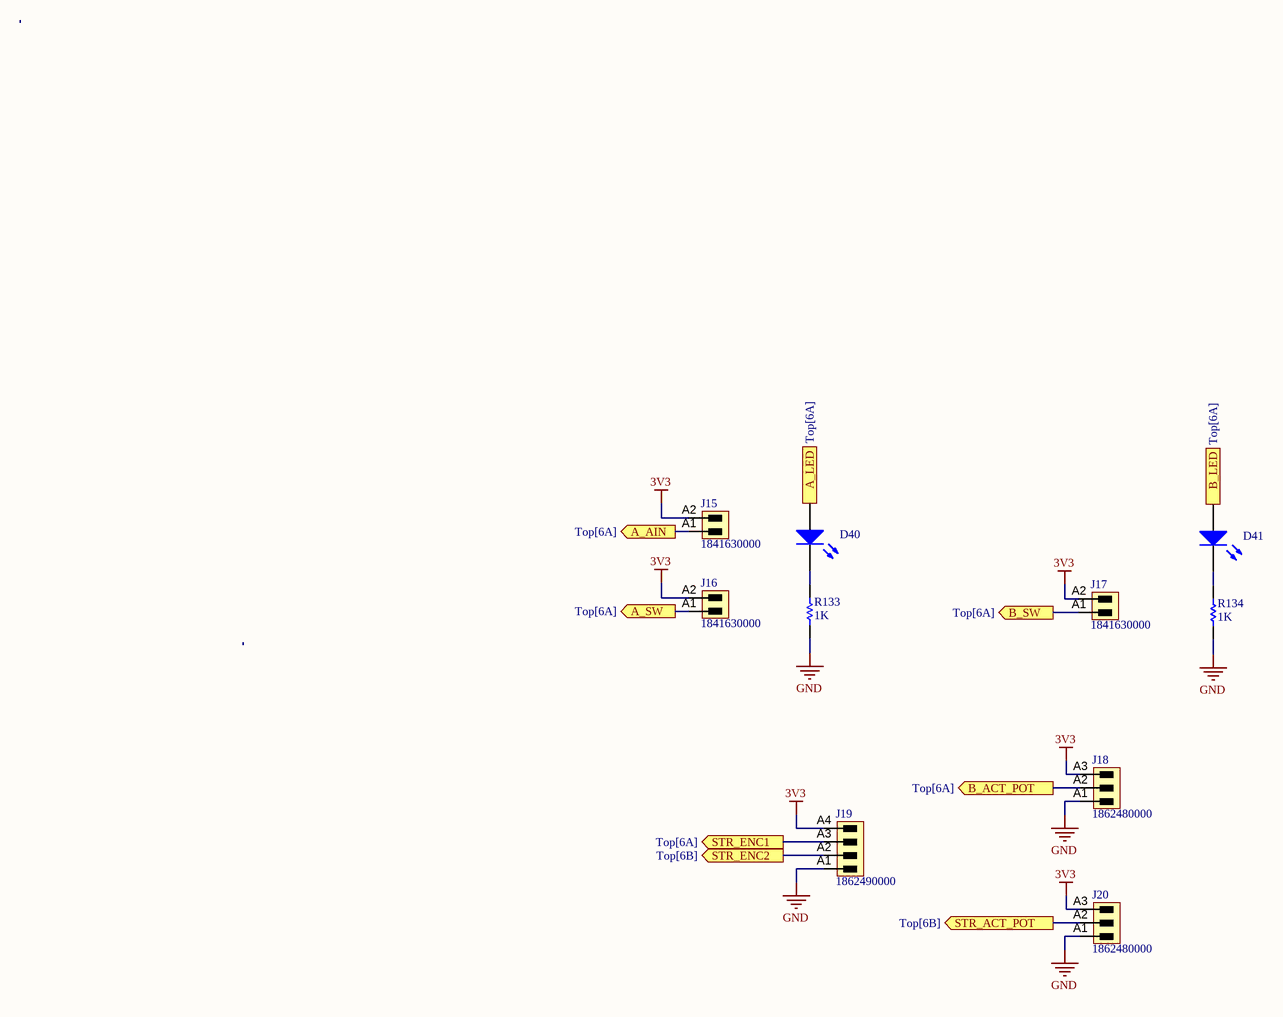
[diagram p5: Inputs.SchDoc]

### Parts
D40  Light-Emitting Diode  (value not drawn)
D41  Light-Emitting Diode  (value not drawn)
J15  1841630000  [SL_SMT_3_5_90G_02]
J16  1841630000  [SL_SMT_3_5_90G_02]
J17  1841630000  [SL_SMT_3_5_90G_02]
J18  1862480000  [SC_SMT_3_81_90G_03]
J19  1862490000  [SC_SMT_3_81_90G_04]
J20  1862480000  [SC_SMT_3_81_90G_03]
R133  value 1K  (hidden comment: Resistor)
R134  value 1K  (hidden comment: Resistor)

### Ports
A_AIN (out, see Top[6A]), A_LED (in, see Top[6A]), A_SW (out, see Top[6A]), B_ACT_POT (out, see Top[6A]), B_LED (in, see Top[6A]), B_SW (out, see Top[6A]), STR_ACT_POT (out, see Top[6B]), STR_ENC1 (out, see Top[6A]), STR_ENC2 (out, see Top[6B])

### Nets
3V3: J15.A2 J16.A2 J17.A2 J18.A3 J19.A4 J20.A3  [project net RDCT]
GND: J18.A1 J19.A1 J20.A1 R133.2 R134.2
NetD40_1: D40.1(A) ; port A_LED
NetD40_2: D40.2(K) R133.1
NetD41_1: D41.1(A) ; port B_LED
NetD41_2: D41.2(K) R134.1
NetJ15_A1: J15.A1 ; port A_AIN
NetJ16_A1: J16.A1 ; port A_SW
NetJ17_A1: J17.A1 ; port B_SW
NetJ18_A2: J18.A2 ; port B_ACT_POT
NetJ19_A2: J19.A2 ; port STR_ENC2
NetJ19_A3: J19.A3 ; port STR_ENC1
NetJ20_A2: J20.A2 ; port STR_ACT_POT

### Notes on the sheet
- THIS DOCUMENT AND THE DATA DISCLOSED HEREIN OR
- HEREWITH IS THE PROPERTY OF ALTIUM LIMITED AND MAY
- DWG NO:
- REVISION
- REV:
- DESCRIPTION
- DATE
- APPROVED
- BE FREELY DISTRIBUTED IN WHOLE. NO RIGHTS ARE
- RESERVED OR EXPRESS OR IMPLIED WARANTEE GIVEN.
- ENG:
- APPROVALS
- PROJECT
- DSN:
- CHK:
- REFERENCE DOCUMENTS
- PROJECT REVISION:
- TITLE
- DOCUMENT REVISION:
- DESIGN ITEM:
- BOM:
- FAB DWG:
- PCB DWG:
- ASSY DWG:
- SCALE:
- A3
- SIZE
- CAGE CODE
- FILE NAME
- DWG NO.
- SHEET
- OF
- REV

### Library data of the parts
D40 D41 = LED: as D1 on sheet Power; CJO: 0; CJP: 0; CTA: 0; CTP: 0; FCS: 0.5; FV_MAX: 1e99; IKF: 0; IKR: 0; ISR: 1e-14; JSW: 0; JTUN: 0; JTUNSW: 0; KEG: 1; KF: 0; LEVEL: 1; N: 1; NBV: 1; NR: 1; NS: 1; PHP: 1; RS: 0; TCV: 0; TLEV: 0; TLEVC: 0; TM1: 0; TM2: 0; TPB: 0; TPHP: 0; TRS: 0; TRS2: 0; TT: 0; TTT1: 0; TTT2: 0; VJ: 1; XTITUN: 3
J15-J17 = CMP-1559-01184-1: as J1 on sheet Power; Revision: V1; Qty: 100 PCS; ComponentLink2URL: http://catalog.weidmueller.com/catalog/Start.do?localeId=en&ObjectID=1841630000; Packaging: Box; Colour: Black; PackageReference: SL_SMT_3_5_90G_02; PartNumber: 1841630000; ComponentLink1Description: Manufacturer URL; ComponentLink1URL: http://www.weidmueller.com/; ComponentLink2Description: URL Link1
J18 J20 = CMP-1559-00516-1: as J2 on sheet Power; Revision: V1; ComponentLink1URL: http://www.weidmueller.com/; ComponentLink2Description: URL Link1; ComponentLink1Description: Manufacturer URL; Colour: Black; ComponentLink2URL: http://catalog.weidmueller.com/catalog/Start.do?localeId=en&ObjectID=1862480000; PartNumber: 1862480000; Packaging: Box; PackageReference: SC_SMT_3_81_90G_03; Qty: 50 PCS
J19 = CMP-1559-00524-1: as J6 on sheet Relays; ComponentLink2Description: URL Link1; Qty: 50 PCS; Colour: Black; ComponentLink1URL: http://www.weidmueller.com/; Packaging: Box; PackageReference: SC_SMT_3_81_90G_04; ComponentLink1Description: Manufacturer URL; ComponentLink2URL: http://catalog.weidmueller.com/catalog/Start.do?localeId=en&ObjectID=1862490000; PartNumber: 1862490000; Revision: V1
R133 R134 = Resistor: TC1: 0; SimulationGenericComponent: True; TC2: 0

## Sheet Ethernet.SchDoc
size 420 x 297 mm; SheetNumber: 6; SheetTotal: 11
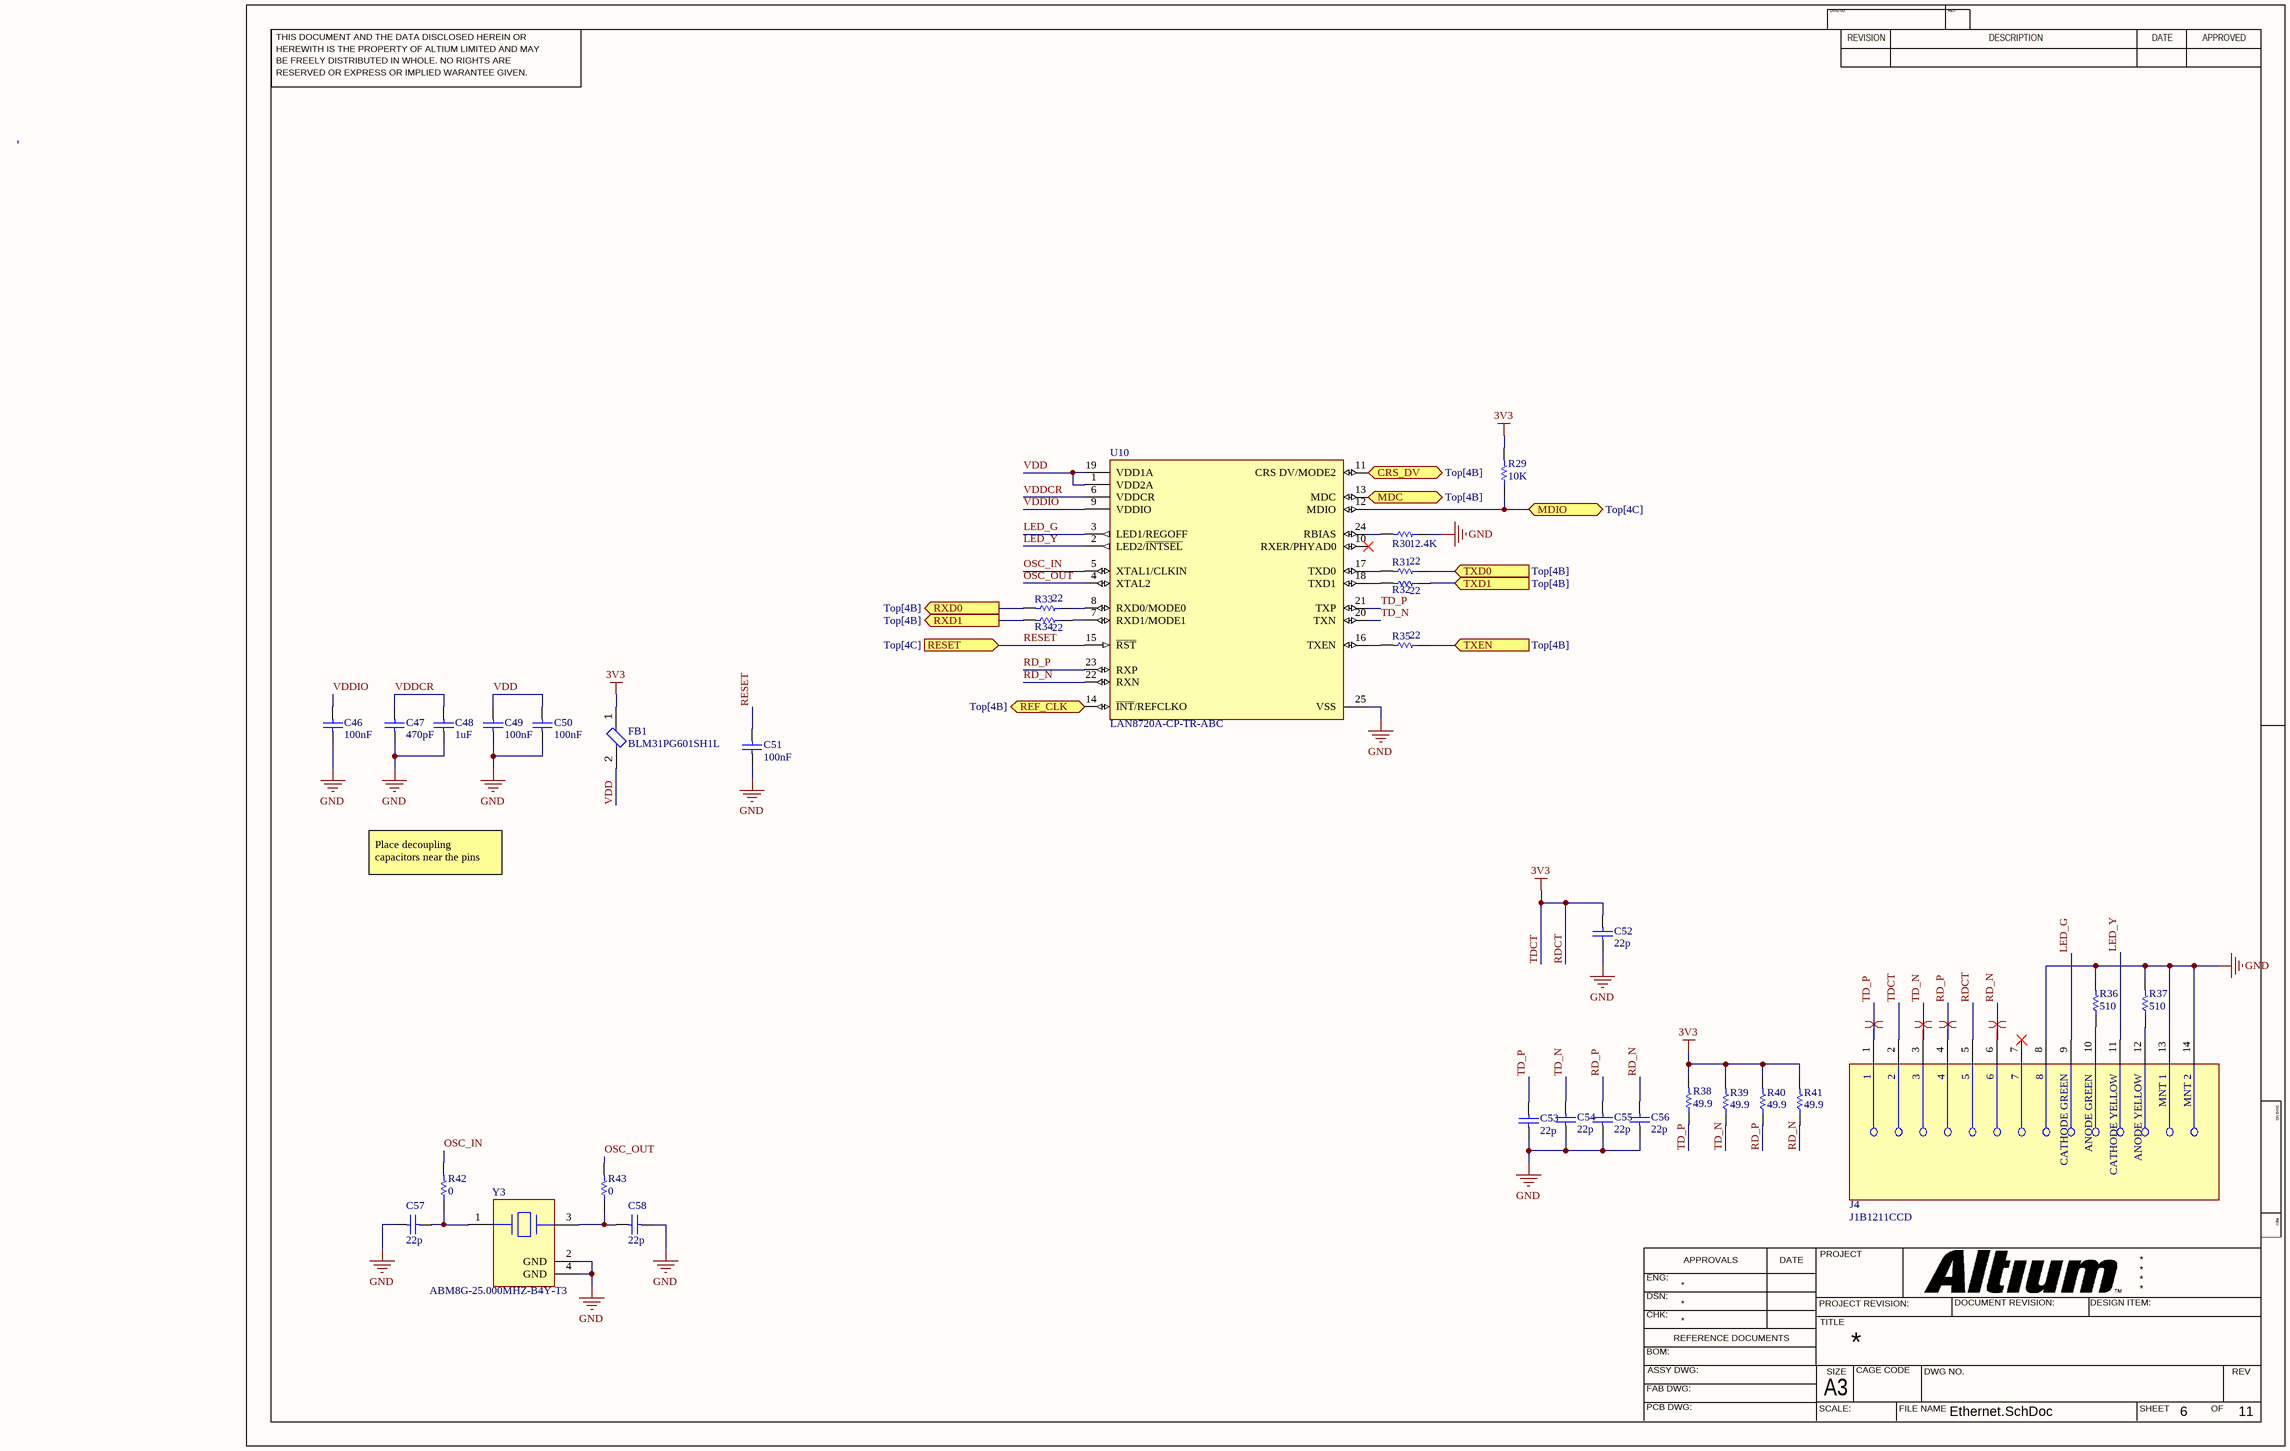
[diagram p6: Ethernet.SchDoc]

### Parts
C46  value 100nF  (hidden comment: Capacitor)
C47  value 470pF  (hidden comment: Capacitor)
C48  value 1uF  (hidden comment: Capacitor)
C49  value 100nF  (hidden comment: Capacitor)
C50  value 100nF  (hidden comment: Capacitor)
C51  value 100nF  (hidden comment: Capacitor)
C52  value 22p  (hidden comment: Capacitor)
C53  value 22p  (hidden comment: Capacitor)
C54  value 22p  (hidden comment: Capacitor)
C55  value 22p  (hidden comment: Capacitor)
C56  value 22p  (hidden comment: Capacitor)
C57  value 22p  (hidden comment: Capacitor)
C58  value 22p  (hidden comment: Capacitor)
FB1  BLM31PG601SH1L  [FP-BLM31-0_2-t1_1-MFG]
J4  J1B1211CCD  [FP-J1B1211CCD-MFG]
R29  value 10K  (hidden comment: Resistor)
R30  value 12.4K  (hidden comment: Resistor)
R31  value 22  (hidden comment: Resistor)
R32  value 22  (hidden comment: Resistor)
R33  value 22  (hidden comment: Resistor)
R34  value 22  (hidden comment: Resistor)
R35  value 22  (hidden comment: Resistor)
R36  value 510  (hidden comment: Resistor)
R37  value 510  (hidden comment: Resistor)
R38  value 49.9  (hidden comment: Resistor)
R39  value 49.9  (hidden comment: Resistor)
R40  value 49.9  (hidden comment: Resistor)
R41  value 49.9  (hidden comment: Resistor)
R42  value 0  (hidden comment: Resistor)
R43  value 0  (hidden comment: Resistor)
U10  LAN8720A-CP-TR-ABC  [FP-24-S4QFN-4x4B-0_5P-IPC_B]
Y3  ABM8G-25.000MHZ-B4Y-T3  [FP-ABM8G-MFG]

### Ports
CRS_DV (bidir, see Top[4B]), MDC (bidir, see Top[4B]), MDIO (bidir, see Top[4C]), REF_CLK (bidir, see Top[4B]), RESET (in, see Top[4C]), RXD0 (out, see Top[4B]), RXD1 (out, see Top[4B]), TXD0 (in, see Top[4B]), TXD1 (in, see Top[4B]), TXEN (in, see Top[4B])

### Nets
GND: C46.1 C47.1 C48.1 C49.1 C50.1 C51.1 C52.1 C53.1 C54.1 C55.1 C56.1 C57.2 C58.1 J4.8 J4.13(MNT_1) J4.14(MNT_2) R30.1 R36.2 R37.2 U10.25(VSS) Y3.2(GND) Y3.4(GND)
RDCT: C52.2 FB1.1 J4.2 J4.5 R29.2 R38.2 R39.2 R40.2 R41.2  [also labelled 3V3, TDCT]
LED_G: J4.9(CATHODE_GREEN) U10.3(LED1/REGOFF)
LED_Y: J4.11(CATHODE_YELLOW) U10.2(LED2/~{INTSEL})
OSC_IN: R42.2 U10.5(XTAL1/CLKIN)
OSC_OUT: R43.2 U10.4(XTAL2)
RD_N: C56.2 J4.6 R41.1 U10.22(RXN)
RD_P: C55.2 J4.4 R40.1 U10.23(RXP)
RESET: C51.2 U10.15(~{RST}) ; port RESET
TD_N: C54.2 J4.3 R39.1 U10.20(TXN)
TD_P: C53.2 J4.1 R38.1 U10.21(TXP)
VDD: C49.2 C50.2 FB1.2 U10.1(VDD2A) U10.19(VDD1A)
VDDCR: C47.2 C48.2 U10.6(VDDCR)
VDDIO: C46.2 U10.9(VDDIO)
NetC57_1: C57.1 R42.1 Y3.1
NetC58_2: C58.2 R43.1 Y3.3
NetJ4_10: J4.10(ANODE_GREEN) R36.1
NetJ4_12: J4.12(ANODE_YELLOW) R37.1
NetR29_1: R29.1 U10.12(MDIO) ; port MDIO
NetR30_2: R30.2 U10.24(RBIAS)
NetR31_1: R31.1 ; port TXD0
NetR31_2: R31.2 U10.17(TXD0)
NetR32_1: R32.1 ; port TXD1
NetR32_2: R32.2 U10.18(TXD1)
NetR33_1: R33.1 U10.8(RXD0/MODE0)
NetR33_2: R33.2 ; port RXD0
NetR34_1: R34.1 U10.7(RXD1/MODE1)
NetR34_2: R34.2 ; port RXD1
NetR35_1: R35.1 ; port TXEN
NetR35_2: R35.2 U10.16(TXEN)
NetU10_11: U10.11(CRS_DV/MODE2) ; port CRS_DV
NetU10_13: U10.13(MDC) ; port MDC
NetU10_14: U10.14(~{INT}/REFCLKO) ; port REF_CLK

Not connected (* = marked no-connect by the designer): J4 7*; U10 10(RXER/PHYAD0)*

### Layout directives
differential pair: RD_N, RD_P, TD_N, TD_P

### Notes on the sheet
- Place decoupling capacitors near the pins
- THIS DOCUMENT AND THE DATA DISCLOSED HEREIN OR
- HEREWITH IS THE PROPERTY OF ALTIUM LIMITED AND MAY
- DWG NO:
- REVISION
- REV:
- DESCRIPTION
- DATE
- APPROVED
- BE FREELY DISTRIBUTED IN WHOLE. NO RIGHTS ARE
- RESERVED OR EXPRESS OR IMPLIED WARANTEE GIVEN.
- ENG:
- APPROVALS
- PROJECT
- DSN:
- CHK:
- REFERENCE DOCUMENTS
- PROJECT REVISION:
- TITLE
- DOCUMENT REVISION:
- DESIGN ITEM:
- BOM:
- FAB DWG:
- PCB DWG:
- ASSY DWG:
- SCALE:
- A3
- SIZE
- CAGE CODE
- FILE NAME
- DWG NO.
- SHEET
- OF
- REV

### Library data of the parts
C46-C58 = Capacitor: SimulationGenericComponent: True
  C46-C51: Supplier 1: Arrow Electronics
FB1 = CMP-06046-002041-1: Chip Ferrite Bead Array, 1206, 600Ω @ 100MHz, 0.08Ω, 25%, 1.5A; Impedance: 600R; DC Resistance (DCR): 90mR; Number of Lines: 1; Shielding: Unshielded; Package Quantity: 3000; Series: EMIFIL®, BLM31P; Core Material: Ferrite; Case Code (Metric): 3216; RoHS Compliant: Yes; Length: 3.2mm; Max Current Rating: 1.5A; Test Frequency: 100MHz; Max Operating Temperature: 125°C; Tolerance: 25%; Termination: SMD/SMT; Height: 1.1mm; Case Code (Imperial): 1206; Lead Free: Lead Free; Width: 0.063inch; Case/Package: 1206; Ratings: AEC-Q200; Mount: Surface Mount; Current Rating: 1.5A; Min Operating Temperature: -55°C; Depth: 1.8mm; Packaging: Tape and Reel; Max DC Current: 1.5A; Material: Ferrite; Resistance: 600R
J4 = CMP-240752-000001-1: CONN JACK 1PORT 100 BASE-T PCB; Number of Cores per Jack: 4; Direction: Down; Connector Type: RJ45; Shielding: Shielded; Number of Ports: 1; Termination: Solder; Packaging: Bulk; Contact Material: Brass; Color: Green; Number of Rows: 1; Mount: Through Hole; Series: -; Contact Plating: Gold; Max Operating Temperature: 85°C; Min Operating Temperature: -40°C; Housing Material: Thermoplastic
R29-R41 = Resistor: TC1: 0; SimulationGenericComponent: True; TC2: 0
R42 R43 = Resistor: SimulationGenericComponent: True; TC1: 0; TC2: 0; Supplier 1: Digi-Key; Supplier Part Number 1: P0.0GCT-ND
U10 = CMP-06281-000039-1: IC TRANSCEIVER FULL 2/2 24SQFN; Simplex/Duplex: Full Duplex; Max Operating Temperature: 85°C; Packaging: Tape and Reel; Min Operating Temperature: 0°C; Mount: Surface Mount
Y3 = CMP-27762-015306-1: as Y1 on sheet MCU; Max Operating Temperature: 70°C; Packaging: Tape and Reel; Length: 0.126inch; Height: 0.039inch; Frequency Stability: 30ppm; Package Quantity: 3000; Width: 2.5mm; Number of Pins: 4; Case/Package: SMD/SMT; Mount: Surface Mount; Series: ABM8G; Load Capacitance: 10pF; Min Operating Temperature: -20°C; Termination: SMD/SMT; Frequency: 25MHz; Tolerance: 30ppm; Frequency Tolerance: 30ppm

## Sheet SD.SchDoc
size 420 x 297 mm; SheetNumber: 4; SheetTotal: 11
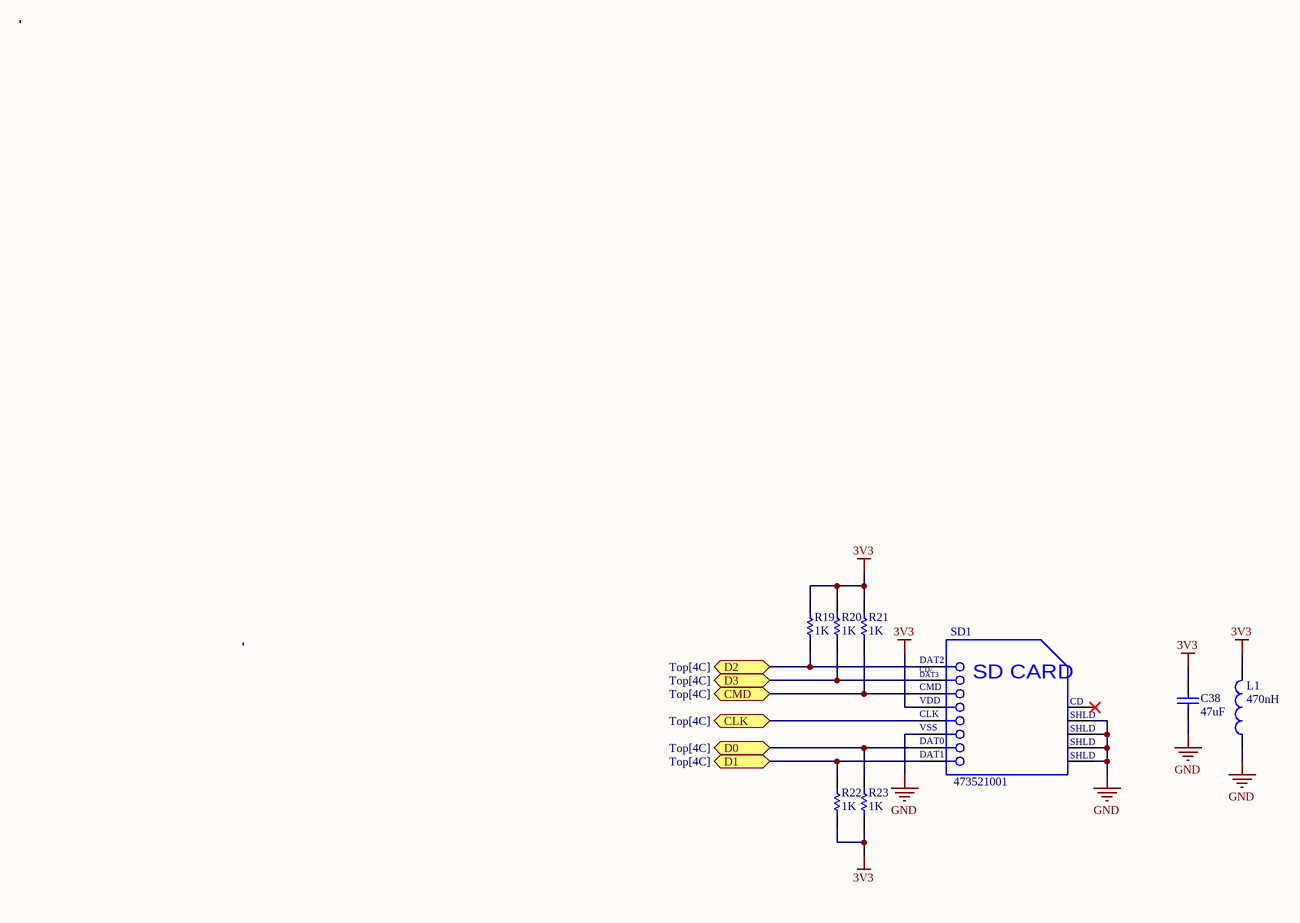
[diagram p7: SD.SchDoc]

### Parts
C38  value 47uF  (hidden comment: Capacitor)
L1  value 470nH  (hidden comment: Inductor)
R19  value 1K  (hidden comment: Resistor)
R20  value 1K  (hidden comment: Resistor)
R21  value 1K  (hidden comment: Resistor)
R22  value 1K  (hidden comment: Resistor)
R23  value 1K  (hidden comment: Resistor)
SD1  473521001  [MOLX-473521001_V]

### Ports
CLK (bidir, see Top[4C]), CMD (bidir, see Top[4C]), D0 (bidir, see Top[4C]), D1 (bidir, see Top[4C]), D2 (bidir, see Top[4C]), D3 (bidir, see Top[4C])

### Nets
3V3: C38.2 L1.2 R19.2 R20.2 R21.2 R22.1 R23.1 SD1.4(VDD)  [project net RDCT]
GND: C38.1 L1.1 SD1.6(VSS) SD1.10(SHLD) SD1.11(SHLD) SD1.12(SHLD) SD1.13(SHLD)
NetR19_1: R19.1 SD1.1(DAT2) ; port D2
NetR20_1: R20.1 SD1.2(CD/DAT3) ; port D3
NetR21_1: R21.1 SD1.3(CMD) ; port CMD
NetR22_2: R22.2 SD1.8(DAT1) ; port D1
NetR23_2: R23.2 SD1.7(DAT0) ; port D0
NetSD1_5: SD1.5(CLK) ; port CLK

Not connected (* = marked no-connect by the designer): SD1 9(CD)*

### Notes on the sheet
- THIS DOCUMENT AND THE DATA DISCLOSED HEREIN OR
- HEREWITH IS THE PROPERTY OF ALTIUM LIMITED AND MAY
- DWG NO:
- REVISION
- REV:
- DESCRIPTION
- DATE
- APPROVED
- BE FREELY DISTRIBUTED IN WHOLE. NO RIGHTS ARE
- RESERVED OR EXPRESS OR IMPLIED WARANTEE GIVEN.
- ENG:
- APPROVALS
- PROJECT
- DSN:
- CHK:
- REFERENCE DOCUMENTS
- PROJECT REVISION:
- TITLE
- DOCUMENT REVISION:
- DESIGN ITEM:
- BOM:
- FAB DWG:
- PCB DWG:
- ASSY DWG:
- SCALE:
- A3
- SIZE
- CAGE CODE
- FILE NAME
- DWG NO.
- SHEET
- OF
- REV
- (in symbol CMP-2000-05848-1) CD/; DAT3; SD CARD

### Library data of the parts
C38 = Capacitor: SimulationGenericComponent: True
L1 = Inductor: SimulationGenericComponent: True
R19-R23 = Resistor: TC1: 0; SimulationGenericComponent: True; TC2: 0
SD1 = CMP-2000-05848-1: MicroSD(TM), Pitch 1.1 mm, 8 Position, Height 1.88 mm, -20 to 85 degC, RoHS, Tape and Reel; Manufacturer: Molex; Datasheet Version: Rev. G, 01/2012; Datasheet URL: http://www.molex.com/pdm_docs/sd/473521001_sd.pdf; Package Reference: 473521001; Manufacturer URL: http://www.molex.com/; Mounting Technology: SurfaceMount; Package Description: MicroSD(TM), Pitch 1.1 mm, 8 Position, Height 1.88 mm